# Altium project GN-1846-E-V2_HI3531A.PRJPCB (part 2 of 5)

## Sheet P11 Hi3531A(SYSTEM)&RES.SchDoc
size 420 x 297 mm
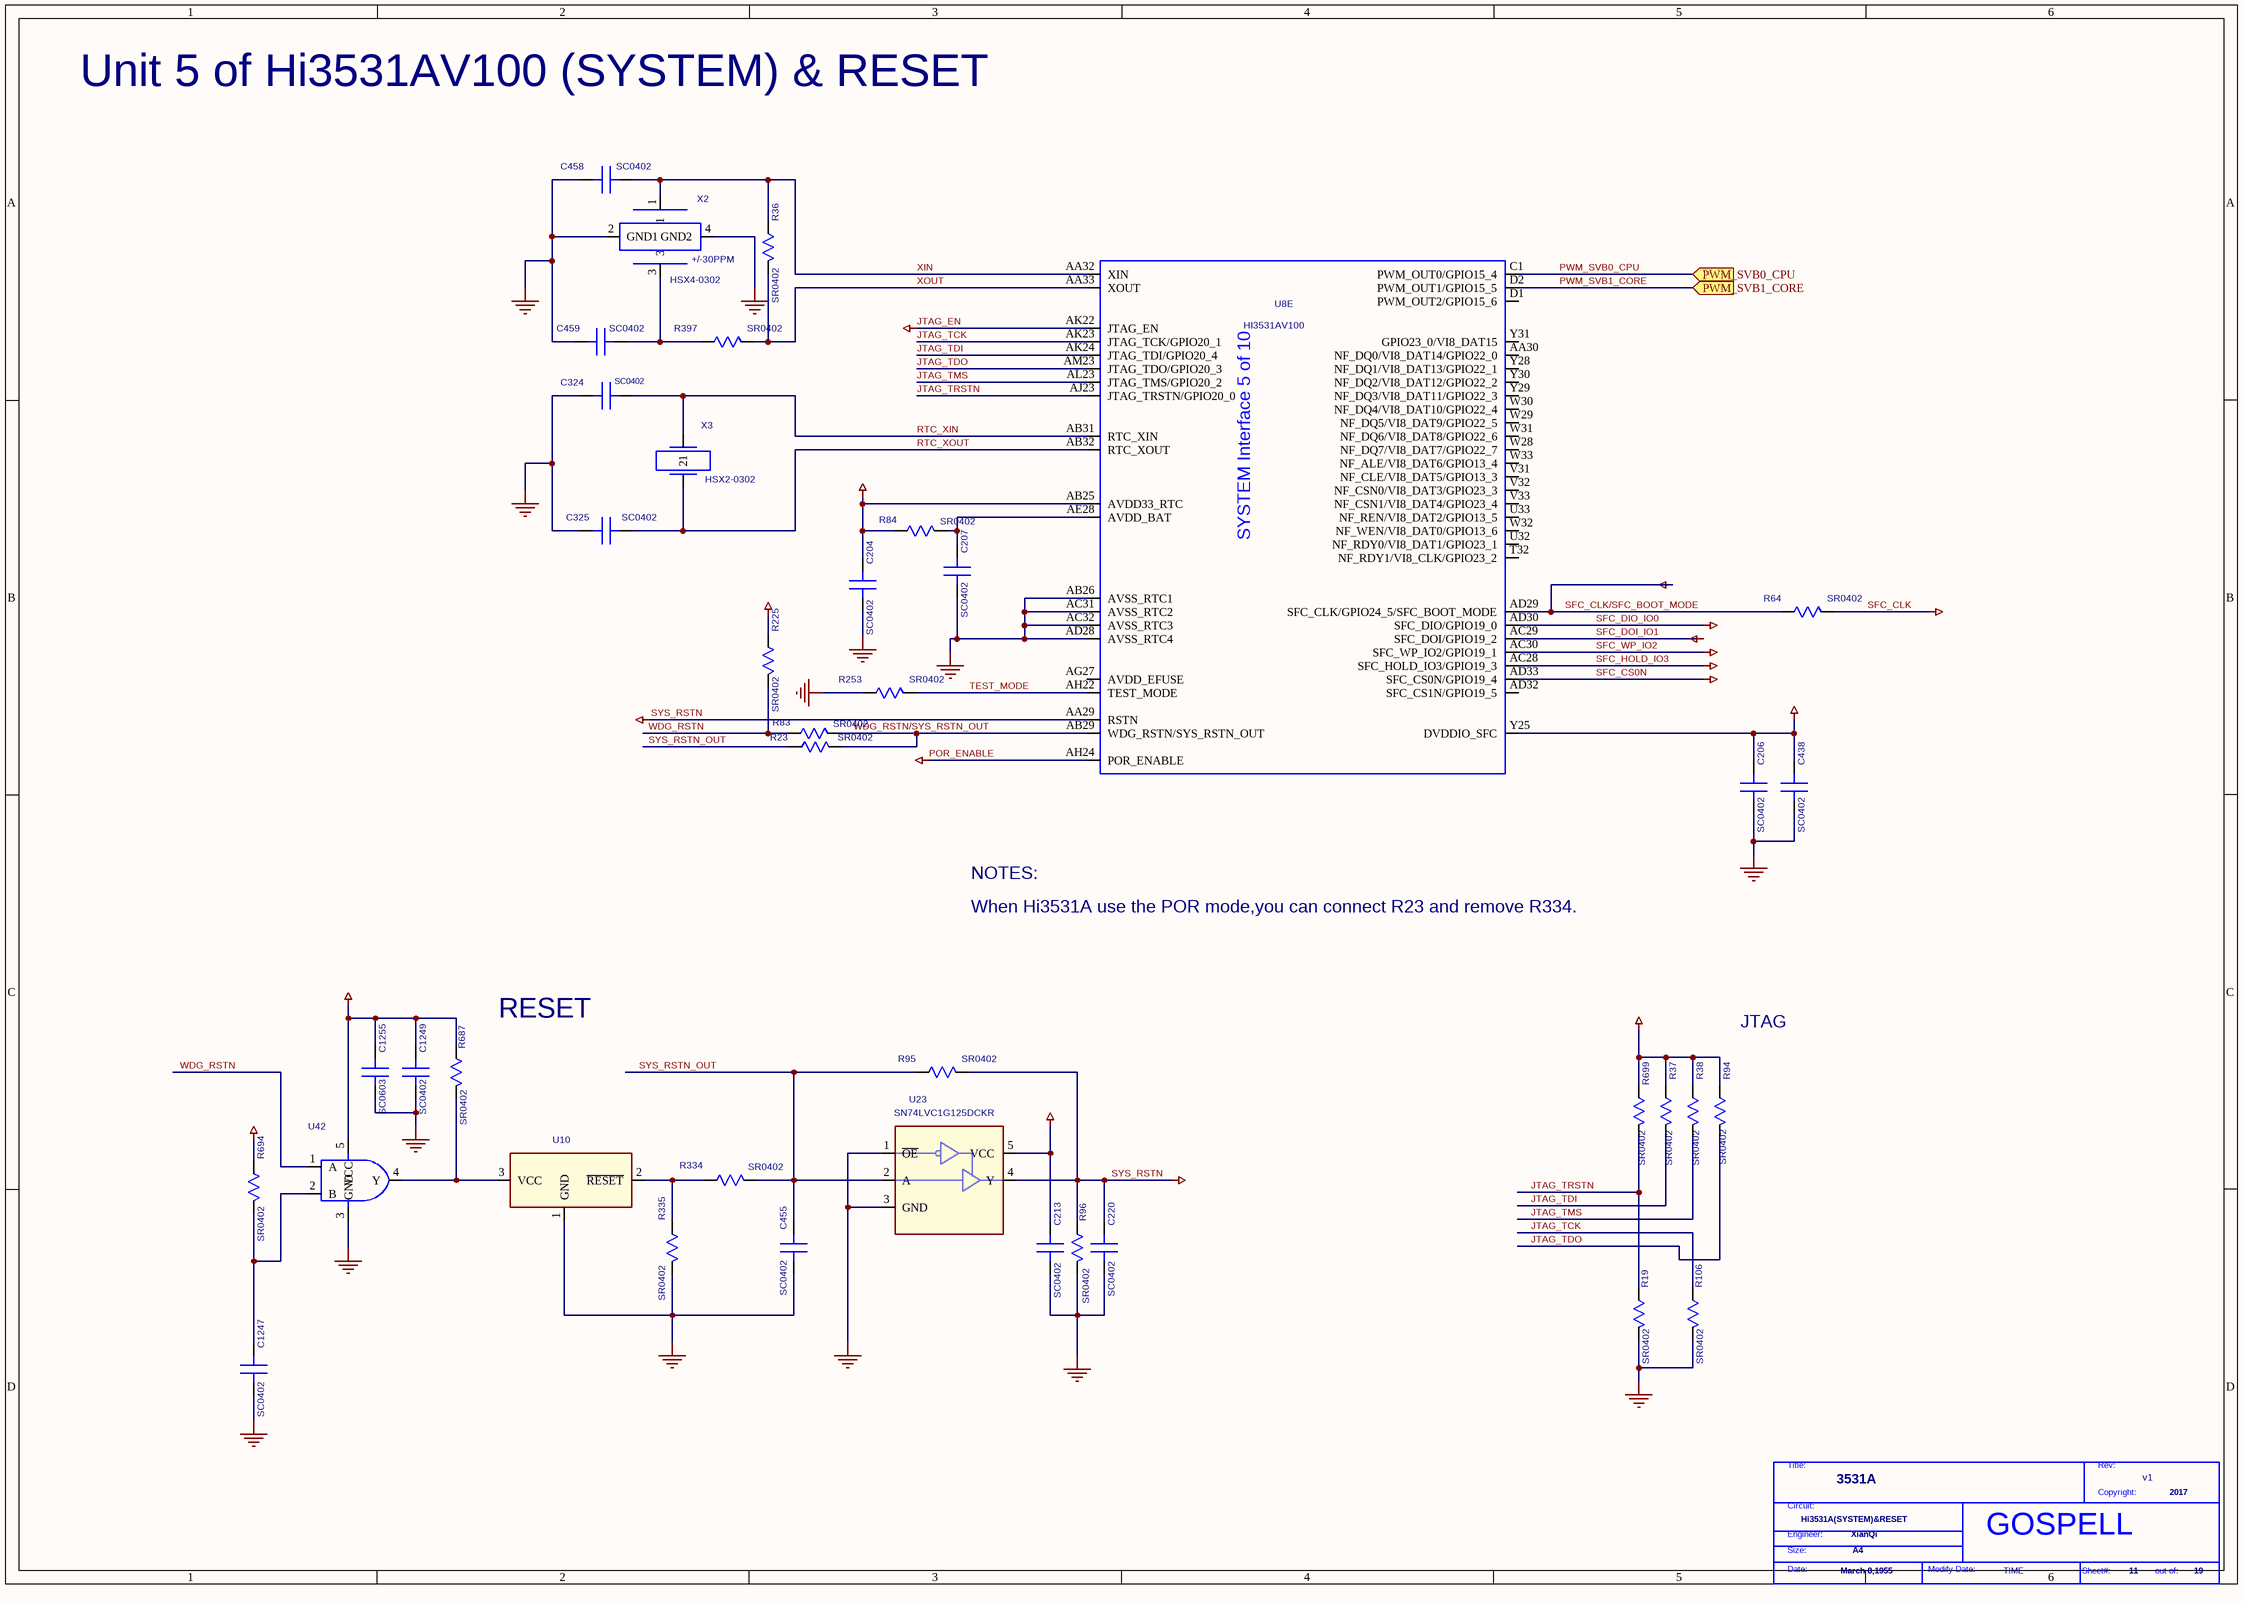
[diagram p7: P11 Hi3531A(SYSTEM)&RES.SchDoc]

### Parts
(Parts that share a designator on the sheet are numbered #1, #2 ... from top to bottom, then left to right.)
*#8  Page Modify Date: TIME  Engineer: XianQi  Copyright: 2017  Title: 3531A  RevCode: v1  Page Size: A4  Page Create Date: March 8,1955  Page Number: 11  Page Count: 19  Doc: Hi3531A(SYSTEM)&RESET  (hidden comment: GOSPELL)  (graphical)
C204  SC0402  [SC0402]
C206  SC0402  [SC0402]
C207  SC0402  [SC0402]
C213  SC0402  [SC0402]
C220  SC0402  [SC0402]
C324  SC0402  [SC0402]
C325  SC0402  [SC0402]
C438  SC0402  [SC0402]
C455  SC0402  [SC0402]
C458  SC0402  [SC0402]
C459  SC0402  [SC0402]
C1247  SC0402  [SC0402]
C1249  SC0402  [SC0402]
C1255  SC0603  [SC0603]
R19  SR0402  [SR0402]
R23  SR0402  [SR0402]
R36  SR0402  [SR0402]
R37  SR0402  [SR0402]
R38  SR0402  [SR0402]
R64  SR0402  [SR0402]
R83  SR0402  [SR0402]
R84  SR0402  [SR0402]
R94  SR0402  [SR0402]
R95  SR0402  [SR0402]
R96  SR0402  [SR0402]
R106  SR0402  [SR0402]
R225  SR0402  [SR0402]
R253  SR0402  [SR0402]
R334  SR0402  [SR0402]
R335  SR0402  [SR0402]
R397  SR0402  [SR0402]
R687  SR0402  [SR0402]
R694  SR0402  [SR0402]
R699  SR0402  [SR0402]
U8  DEVICE: HI3531AV100  [BGA805-32-3333]  (hidden comment: BGA805-32-3333)  (part E of 10)
U10  SOT23B  [SOT23B]  (value not drawn)
U23  DEVICE: SN74LVC1G125DCKR  [HSOT-SC70-DCK]  (hidden comment: HSOT-SC70-DCK)
U42  SOT23-5C  [SOT23-5C]  (value not drawn)
X2  HSX4-0302  [HSX4-0302]
X3  HSX2-0302  [HSX2-0302]

### Ports
PWM_SVB0_CPU (in), PWM_SVB1_CORE (in)

### Nets
3V3: C204.1(A) C206.1(A) C213.1(A) C438.1(A) C1249.1(A) C1255.1(A) R37.1(A) R38.1(A) R84.1(A) R94.1(A) R225.1(A) R687.1(A) R694.1(A) R699.1(A) U8.AB25(AVDD33_RTC) U8.Y25(DVDDIO_SFC) U23.5(VCC) U42.5(VCC)
GND: C204.2(B) C206.2(B) C207.2(B) C213.2(B) C220.2(B) C324.1(A) C325.1(A) C438.2(B) C455.2(B) C458.1(A) C459.1(A) C1247.2(B) C1249.2(B) C1255.2(B) R19.2(B) R96.2(B) R106.2(B) R253.1(A) R335.2(B) U8.AB26(AVSS_RTC1) U8.AC31(AVSS_RTC2) U8.AC32(AVSS_RTC3) U8.AD28(AVSS_RTC4) U10.1(GND) U23.1(~{OE}) U23.3(GND) U42.3(GND) X2.2(GND1) X2.4(GND2)
JTAG_EN: U8.AK22(JTAG_EN)
POR_ENABLE: U8.AH24(POR_ENABLE)
SFC_CLK: R64.2(B)
SFC_CLK/SFC_BOOT_MODE: R64.1(A) U8.AD29(SFC_CLK/GPIO24_5/SFC_BOOT_MODE)
SFC_CS0N: U8.AD33(SFC_CS0N/GPIO19_4)
SFC_DIO_IO0: U8.AD30(SFC_DIO/GPIO19_0)
SFC_DOI_IO1: U8.AC29(SFC_DOI/GPIO19_2)
SFC_HOLD_IO3: U8.AC28(SFC_HOLD_IO3/GPIO19_3)
SFC_WP_IO2: U8.AC30(SFC_WP_IO2/GPIO19_1)
SYS_RSTN: C220.1(A) R95.2(B) R96.1(A) U8.AA29(RSTN) U23.4(Y)
JTAG_TCK: R106.1(A) U8.AK23(JTAG_TCK/GPIO20_1)
JTAG_TDI: R37.2(B) U8.AK24(JTAG_TDI/GPIO20_4)
JTAG_TDO: R94.2(B) U8.AM23(JTAG_TDO/GPIO20_3)
JTAG_TMS: R38.2(B) U8.AL23(JTAG_TMS/GPIO20_2)
JTAG_TRSTN: R19.1(A) R699.2(B) U8.AJ23(JTAG_TRSTN/GPIO20_0)
PWM_SVB0_CPU: U8.C1(PWM_OUT0/GPIO15_4) ; port PWM_SVB0_CPU
PWM_SVB1_CORE: U8.D2(PWM_OUT1/GPIO15_5) ; port PWM_SVB1_CORE
RTC_XIN: C324.2(B) U8.AB31(RTC_XIN) X3.1
RTC_XOUT: C325.2(B) U8.AB32(RTC_XOUT) X3.2
SYS_RSTN_OUT: C455.1(A) R23.1(A) R95.1(A) R334.2(B) U23.2(A)
TEST_MODE: R253.2(B) U8.AH22(TEST_MODE)
WDG_RSTN: R83.1(A) R225.2(B) U42.1(A)
WDG_RSTN/SYS_RSTN_OUT: R23.2(B) R83.2(B) U8.AB29(WDG_RSTN/SYS_RSTN_OUT)
XIN: C458.2(B) R36.1(A) U8.AA32(XIN) X2.1
XOUT: R36.2(B) R397.2(B) U8.AA33(XOUT)
NetC207_1: C207.1(A) R84.2(B) U8.AE28(AVDD_BAT)
NetC459_2: C459.2(B) R397.1(A) X2.3
NetC1247_1: C1247.1(A) R694.2(B) U42.2(B)
NetR334_1: R334.1(A) R335.1(A) U10.2(~{RESET})
NetR687_2: R687.2(B) U10.3(VCC) U42.4(Y)

Not connected (* = marked no-connect by the designer): U8 AA30(NF_DQ0/VI8_DAT14/GPIO22_0) AD32(SFC_CS1N/GPIO19_5) AG27(AVDD_EFUSE) D1(PWM_OUT2/GPIO15_6) T32(NF_RDY1/VI8_CLK/GPIO23_2) U32(NF_RDY0/VI8_DAT1/GPIO23_1) U33(NF_REN/VI8_DAT2/GPIO13_5) V31(NF_CLE/VI8_DAT5/GPIO13_3) V32(NF_CSN0/VI8_DAT3/GPIO23_3) V33(NF_CSN1/VI8_DAT4/GPIO23_4) W28(NF_DQ7/VI8_DAT7/GPIO22_7) W29(NF_DQ5/VI8_DAT9/GPIO22_5) W30(NF_DQ4/VI8_DAT10/GPIO22_4) W31(NF_DQ6/VI8_DAT8/GPIO22_6) W32(NF_WEN/VI8_DAT0/GPIO13_6) W33(NF_ALE/VI8_DAT6/GPIO13_4) Y28(NF_DQ1/VI8_DAT13/GPIO22_1) Y29(NF_DQ3/VI8_DAT11/GPIO22_3) Y30(NF_DQ2/VI8_DAT12/GPIO22_2) Y31(GPIO23_0/VI8_DAT15)

### Notes on the sheet
- Unit 5 of Hi3531AV100 (SYSTEM) & RESET
- (near X2) +/-30PPM
- When Hi3531A use the POR mode,you can connect R23 and remove R334.
- NOTES:
- (near R687) RESET
- JTAG
- (in symbol GOSPELL) Title:; Rev:; Copyright:; Circuit:; Engineer:; Size:; Date:; Modify Date:; Sheet#:; out of:
- (in symbol HI3531AV100_M2_17, part E) SYSTEM Interface 5 of 10

### Library data of the parts
C204 C206 C207 C1247 = C_0_Dup2: PARTS: 1; PINSWAP: (A,B); LEVEL: STD; DEVICE: RMEMK105BJ104KV_FR; OriginalSymbolOrigin: (0,30); %208%%161%%192%%224%%195%%251%%179%%198%: SMD陶瓷电容; COMPONENT_HIGH_MAX: 0.55MM; %182%%238%%182%%168%%185%%164%%215%%247%%181%%231%%209%%185%(V): 16; %195%%232%%202%%246%: SMD陶瓷电容-16V-100NF-+/-10%-X7R-0402-BT; CODE: 8070614; PKG_TYPE: SC0402
C213 = C_0_Dup2: PARTS: 1; PINSWAP: (A,B); LEVEL: STD; DEVICE: RMEMK105BJ104KV_FR; OriginalSymbolOrigin: (0,30); CODE: 8070614; %195%%232%%202%%246%: SMD陶瓷电容-16V-100NF-+/-10%-X7R-0402-BT; %182%%238%%182%%168%%185%%164%%215%%247%%181%%231%%209%%185%(V): 16; COMPONENT_HIGH_MAX: 0.55MM; %208%%161%%192%%224%%195%%251%%179%%198%: SMD陶瓷电容; PKG_TYPE: SC0402
C220 C455 = C_0_Dup2: PARTS: 1; PINSWAP: (A,B); LEVEL: STD; DEVICE: 04025C102KAT2A; OriginalSymbolOrigin: (0,30); CODE: 8070531; %195%%232%%202%%246%: SMD陶瓷电容-50V-1NF-+/-10%-X7R-0402-BT; %182%%238%%182%%168%%185%%164%%215%%247%%181%%231%%209%%185%(V): 50; COMPONENT_HIGH_MAX: 0.56MM; %208%%161%%192%%224%%195%%251%%179%%198%: SMD陶瓷电容; PKG_TYPE: SC0402
C324 C325 = C_0_Dup2: PARTS: 1; PINSWAP: (A,B); LEVEL: STD; DEVICE: RMUMK105CG220JV_F; OriginalSymbolOrigin: (0,30); %208%%161%%192%%224%%195%%251%%179%%198%: SMD陶瓷电容; COMPONENT_HIGH_MAX: 0.55MM; %182%%238%%182%%168%%185%%164%%215%%247%%181%%231%%209%%185%(V): 50; %195%%232%%202%%246%: SMD陶瓷电容-50V-0.022NF-+/-5%-NP0-0402-BT; CODE: 8070545; PKG_TYPE: SC0402
C438 = C_0_Dup2: PARTS: 1; PINSWAP: (A,B); LEVEL: STD; DEVICE: C1005X5R0J475MTJ00F; OriginalSymbolOrigin: (0,30); %208%%161%%192%%224%%195%%251%%179%%198%: SMD陶瓷电容; COMPONENT_HIGH_MAX: 0.65MM; %182%%238%%182%%168%%185%%164%%215%%247%%181%%231%%209%%185%(V): 6.3; %195%%232%%202%%246%: SMD陶瓷电容-6.3V-4700NF-+/-20%-X5R-0402; CODE: 8071610; PKG_TYPE: SC0402
C458 C459 = C_0_Dup2: PARTS: 1; PINSWAP: (A,B); LEVEL: STD; DEVICE: C0402C150J5GAC_7867; OriginalSymbolOrigin: (0,30); CODE: 08070580; %195%%232%%202%%246%: SMD陶瓷电容-50V-0.015NF-+/-5%-NP0-0402; %182%%238%%182%%168%%185%%164%%215%%247%%181%%231%%209%%185%(V): 50; COMPONENT_HIGH_MAX: 0.55MM; %208%%161%%192%%224%%195%%251%%179%%198%: SMD陶瓷电容; PKG_TYPE: SC0402
C1249 = C_0_Dup2: PARTS: 1; PINSWAP: (A,B); LEVEL: STD; DEVICE: C0402C104K8PAC_7867; OriginalSymbolOrigin: (0,30); CODE: 8070561; %195%%232%%202%%246%: SMD陶瓷电容-10V-100NF-+/-10%-X5R-0402; %182%%238%%182%%168%%185%%164%%215%%247%%181%%231%%209%%185%(V): 10; COMPONENT_HIGH_MAX: 0.55MM; %208%%161%%192%%224%%195%%251%%179%%198%: SMD陶瓷电容; ALT_SYMBOLS: (T:SC0402;B:SC0402,SC0402-BGA,SC0402-BGA-A); TECHNIC: 回流回流; PKG_TYPE: SC0402
C1255 = C_0_Dup2: PARTS: 1; PINSWAP: (A,B); LEVEL: STD; DEVICE: C1608X5R0J106MT0A0E_A; OriginalSymbolOrigin: (0,30); %208%%161%%192%%224%%195%%251%%179%%198%: SMD陶瓷电容; COMPONENT_HIGH_MAX: 0.9MM; %182%%238%%182%%168%%185%%164%%215%%247%%181%%231%%209%%185%(V): 6.3; %195%%232%%202%%246%: SMD陶瓷电容-6.3V-10000NF-+/-20%-X5R-0603; CODE: 8070821; PKG_TYPE: SC0603
R19 = R_2: PARTS: 1; OriginalSymbolOrigin: (10,20); PINSWAP: (A,B); DEVICE: RK73H1ETTP1002F; LEVEL: STD; %208%%161%%192%%224%%195%%251%%179%%198%: 片式厚膜电阻器; COMPONENT_HIGH_MAX: 0.4MM; %215%%232%%214%%181%%212%%202%%208%%237%%198%%171%%178%%238%: +/-1%; %182%%238%%182%%168%%185%%166%%194%%202%(W): 0.06; %195%%232%%202%%246%: 片式厚膜电阻器-0.0625W-10000OHM-+/-1%-0402-BT; CODE: 7090867; PKG_TYPE: SR0402
R23 R95 = R_1: PARTS: 1; LEVEL: STD; DEVICE: RC0402JR_070R; PINSWAP: (A,B); OriginalSymbolOrigin: (10,20); CODE: 7090800; %195%%232%%202%%246%: 片式厚膜电阻器-0.0625W-0OHM-< 50MOHM-0402-1A-BT; %182%%238%%182%%168%%185%%166%%194%%202%(W): 0.06; %215%%232%%214%%181%%212%%202%%208%%237%%198%%171%%178%%238%: < 50MOHM; COMPONENT_HIGH_MAX: 0.4MM; %208%%161%%192%%224%%195%%251%%179%%198%: 片式厚膜电阻器; PKG_TYPE: SR0402
R36 = R_1: PARTS: 1; LEVEL: STD; DEVICE: RK73H1ETTP1004F; PINSWAP: (A,B); OriginalSymbolOrigin: (10,20); %208%%161%%192%%224%%195%%251%%179%%198%: 片式厚膜电阻器; COMPONENT_HIGH_MAX: 0.4MM; %215%%232%%214%%181%%212%%202%%208%%237%%198%%171%%178%%238%: ±1%; %182%%238%%182%%168%%185%%166%%194%%202%(W): 0.06; %195%%232%%202%%246%: 片式厚膜电阻器-0.0625W-1000000OHM-±1%-0402; CODE: 7090857; PKG_TYPE: SR0402
R37 = R_2: PARTS: 1; OriginalSymbolOrigin: (10,20); PINSWAP: (A,B); DEVICE: RK73B1ELTP472J; LEVEL: STD; %208%%161%%192%%224%%195%%251%%179%%198%: 片式厚膜电阻器; COMPONENT_HIGH_MAX: 0.4MM; %215%%232%%214%%181%%212%%202%%208%%237%%198%%171%%178%%238%: +/-5%; %182%%238%%182%%168%%185%%166%%194%%202%(W): 0.06; %195%%232%%202%%246%: 片式厚膜电阻器-0.0625W-4700OHM-+/-5%-0402-BT; CODE: 7090793; PKG_TYPE: SR0402
R38 R94 R699 = R_2: PARTS: 1; OriginalSymbolOrigin: (10,20); PINSWAP: (A,B); DEVICE: RK73B1ELTP472J; LEVEL: STD; CODE: 7090793; %195%%232%%202%%246%: 片式厚膜电阻器-0.0625W-4700OHM-+/-5%-0402-BT; %182%%238%%182%%168%%185%%166%%194%%202%(W): 0.06; %215%%232%%214%%181%%212%%202%%208%%237%%198%%171%%178%%238%: +/-5%; COMPONENT_HIGH_MAX: 0.4MM; %208%%161%%192%%224%%195%%251%%179%%198%: 片式厚膜电阻器; PKG_TYPE: SR0402
R64 = R_1: PARTS: 1; LEVEL: STD; DEVICE: RC0402FR_0733RL; PINSWAP: (A,B); OriginalSymbolOrigin: (10,20); CODE: 7090836; %195%%232%%202%%246%: 片式厚膜电阻器-0.0625W-33OHM-+/-1%-0402; %182%%238%%182%%168%%185%%166%%194%%202%(W): 0.06; %215%%232%%214%%181%%212%%202%%208%%237%%198%%171%%178%%238%: +/-1%; COMPONENT_HIGH_MAX: 0.4MM; %208%%161%%192%%224%%195%%251%%179%%198%: 片式厚膜电阻器; PKG_TYPE: SR0402
R83 R84 = R_1: PARTS: 1; LEVEL: STD; DEVICE: RC0402JR_070R; PINSWAP: (A,B); OriginalSymbolOrigin: (10,20); %208%%161%%192%%224%%195%%251%%179%%198%: 片式厚膜电阻器; COMPONENT_HIGH_MAX: 0.4MM; %215%%232%%214%%181%%212%%202%%208%%237%%198%%171%%178%%238%: < 50MOHM; %182%%238%%182%%168%%185%%166%%194%%202%(W): 0.06; %195%%232%%202%%246%: 片式厚膜电阻器-0.0625W-0OHM-< 50MOHM-0402-1A-BT; CODE: 7090800; PKG_TYPE: SR0402
R96 = R_1: PARTS: 1; LEVEL: STD; DEVICE: RC0402FR_071KL; PINSWAP: (A,B); OriginalSymbolOrigin: (10,20); %208%%161%%192%%224%%195%%251%%179%%198%: 片式厚膜电阻器; COMPONENT_HIGH_MAX: 0.4MM; %215%%232%%214%%181%%212%%202%%208%%237%%198%%171%%178%%238%: +/-1%; %182%%238%%182%%168%%185%%166%%194%%202%(W): 0.06; %195%%232%%202%%246%: 片式厚膜电阻器-0.0625W-1000OHM-+/-1%-0402-BT; CODE: 7091282; PKG_TYPE: SR0402
R106 = R_2: PARTS: 1; OriginalSymbolOrigin: (10,20); PINSWAP: (A,B); DEVICE: RC0402FR_071KL; LEVEL: STD; CODE: 7091282; %195%%232%%202%%246%: 片式厚膜电阻器-0.0625W-1000OHM-+/-1%-0402-BT; %182%%238%%182%%168%%185%%166%%194%%202%(W): 0.06; %215%%232%%214%%181%%212%%202%%208%%237%%198%%171%%178%%238%: +/-1%; COMPONENT_HIGH_MAX: 0.4MM; %208%%161%%192%%224%%195%%251%%179%%198%: 片式厚膜电阻器; PKG_TYPE: SR0402
R225 = R_1: PARTS: 1; LEVEL: STD; DEVICE: RK73B1ELTP472J; PINSWAP: (A,B); OriginalSymbolOrigin: (10,20); CODE: 7090793; %195%%232%%202%%246%: 片式厚膜电阻器-0.0625W-4700OHM-+/-5%-0402-BT; %182%%238%%182%%168%%185%%166%%194%%202%(W): 0.06; %215%%232%%214%%181%%212%%202%%208%%237%%198%%171%%178%%238%: +/-5%; COMPONENT_HIGH_MAX: 0.4MM; %208%%161%%192%%224%%195%%251%%179%%198%: 片式厚膜电阻器; PKG_TYPE: SR0402
R253 = R_1: PARTS: 1; LEVEL: STD; DEVICE: RK73B1ELTP472J; PINSWAP: (A,B); OriginalSymbolOrigin: (10,20); %208%%161%%192%%224%%195%%251%%179%%198%: 片式厚膜电阻器; COMPONENT_HIGH_MAX: 0.4MM; %215%%232%%214%%181%%212%%202%%208%%237%%198%%171%%178%%238%: +/-5%; %182%%238%%182%%168%%185%%166%%194%%202%(W): 0.06; %195%%232%%202%%246%: 片式厚膜电阻器-0.0625W-4700OHM-+/-5%-0402-BT; CODE: 7090793; PKG_TYPE: SR0402
R334 = R_1: PARTS: 1; LEVEL: STD; DEVICE: RC0402JR_07100R; PINSWAP: (A,B); OriginalSymbolOrigin: (10,20); %208%%161%%192%%224%%195%%251%%179%%198%: 片式厚膜电阻器; COMPONENT_HIGH_MAX: 0.4MM; %215%%232%%214%%181%%212%%202%%208%%237%%198%%171%%178%%238%: +/-5%; %182%%238%%182%%168%%185%%166%%194%%202%(W): 0.06; %195%%232%%202%%246%: 片式厚膜电阻器-0.0625W-100OHM-+/-5%-0402-BT; CODE: 7090807; PKG_TYPE: SR0402
R335 = R_1: PARTS: 1; LEVEL: STD; DEVICE: RK73H1ETTP1003F; PINSWAP: (A,B); OriginalSymbolOrigin: (10,20); %208%%161%%192%%224%%195%%251%%179%%198%: 片式厚膜电阻器; COMPONENT_HIGH_MAX: 0.4MM; %215%%232%%214%%181%%212%%202%%208%%237%%198%%171%%178%%238%: +/-1%; %182%%238%%182%%168%%185%%166%%194%%202%(W): 0.06; %195%%232%%202%%246%: 片式厚膜电阻器-0.0625W-100000OHM-+/-1%-0402; CODE: 7090875; PKG_TYPE: SR0402
R397 = R_1: PARTS: 1; LEVEL: STD; DEVICE: RC_02W100FT; PINSWAP: (A,B); OriginalSymbolOrigin: (10,20); %208%%161%%192%%224%%195%%251%%179%%198%: 片式厚膜电阻器; COMPONENT_HIGH_MAX: 0.4MM; %215%%232%%214%%181%%212%%202%%208%%237%%198%%171%%178%%238%: +/-1%; %182%%238%%182%%168%%185%%166%%194%%202%(W): 0.06; %195%%232%%202%%246%: 片式厚膜电阻器-0.0625W-10OHM-+/-1%-0402; CODE: 7091305; PKG_TYPE: SR0402
R687 = R_1: PARTS: 1; LEVEL: STD; DEVICE: RC0402JR_071KL; PINSWAP: (A,B); OriginalSymbolOrigin: (10,20); CODE: 7090809; %195%%232%%202%%246%: 片式厚膜电阻器-0.0625W-1000OHM-+/-5%-0402-BT; %182%%238%%182%%168%%185%%166%%194%%202%(W): 0.06; %215%%232%%214%%181%%212%%202%%208%%237%%198%%171%%178%%238%: +/-5%; %208%%161%%192%%224%%195%%251%%179%%198%: 片式厚膜电阻器; PKG_TYPE: SR0402
R694 = R_1: PARTS: 1; LEVEL: STD; DEVICE: RK73B1ELTP472J; PINSWAP: (A,B); OriginalSymbolOrigin: (10,20); %208%%161%%192%%224%%195%%251%%179%%198%: 片式厚膜电阻器; COMPONENT_HIGH_MAX: 0.4MM; %215%%232%%214%%181%%212%%202%%208%%237%%198%%171%%178%%238%: ±5％; %182%%238%%182%%168%%185%%166%%194%%202%(W): 0.06; %195%%232%%202%%246%: 片式厚膜电阻器-0.0625W-4700OHM-+/-5%-0402-BT; CODE: 7090793; PKG_TYPE: SR0402
U8 = HI3531AV100_M2_17: FORWARD_PCB: 1; HETERO: (HI3531AV100_DDR1),(HI3531AV100_DDR2),(HI3531AV100_SYSTEM),(HI3531AV100_AD),(HI3531AV100_VO),(HI3531AV100_M1),(HI3531AV100_M2),(HI3531AV100_POWER),(HI3531AV100_VSS1),(HI3531AV100_VSS2); LEVEL: STD; OriginalSymbolOrigin: (30,630); CaptureCellPackProp: HI3531AV100_M2E; CODE: 35020607; PARTS: 1; PKG_TYPE: BGA805-32-3333
U10 = ADM809_0: PARTS: 1; DEVICE: PT7M7809RTE; LEVEL: STD; CODE: 39070039; OriginalSymbolOrigin: (10,60); COMPONENT_HIGH_MAX: 1.45MM; %195%%232%%202%%246%: POWER MANAGEMENT IC-3.3V-电压监测-2.63VTH-PUSH-PULL OUTPUT-SOT23-终端专用; PKG_TYPE: SOT23B
U23 = SN74LVC1G125Q-Q1_1: PARTS: 1; LEVEL: STD; CODE: 36020340; OriginalSymbolOrigin: (10,90); %195%%232%%202%%246%: CMOS-单门三态缓冲器-SOT23-6.9NS-24MA-LVTTL-LVTTL; %208%%161%%192%%224%%195%%251%%179%%198%: CMOS; SIGNAL_MODEL: 74LVC1G125DBVR_SOT5; PKG_TYPE: HSOT-SC70-DCK
U42 = NC7SZ08P5X_0: PARTS: 1; DEVICE: NC7SV08P5X; LEVEL: STD; CODE: 36020363; OriginalSymbolOrigin: (20,50); %195%%232%%202%%246%: CMOS-SINGLE 2-INPUT POSITIVE-AND GATE-SC-70-2.4NS-16MA-CMOS-CMOS-终端专用; COMPONENT_HIGH_MAX: 1.1MM; PKG_TYPE: SOT23-5C
X2 = X_B_7: PARTS: 1; CODE: 12020151; DEVICE: NX3225SA24MHZ; LEVEL: STD; OriginalSymbolOrigin: (20,80); COMPONENT_HIGH_MAX: 0.75MM; %195%%232%%202%%246%: 晶体谐振器-24MHZ-12PF-±30PPM-50OHM-HCX-3SB-终端专用; PKG_TYPE: HSX4-0302
X3 = X_1: PARTS: 1; CODE: 12020212; DEVICE: 9H03200019; LEVEL: STD; OriginalSymbolOrigin: (10,40); %195%%232%%202%%246%: 晶体谐振器-0.032768MHZ-12.5PF-+/-20PPM-70000OHM-SMD3.2*1.5; COMPONENT_HIGH_MAX: 0.85MM; %208%%161%%192%%224%%195%%251%%179%%198%: 晶体谐振器; PKG_TYPE: HSX2-0302

## Sheet P10 DDRC&D NOVTT.SchDoc
size 420 x 297 mm
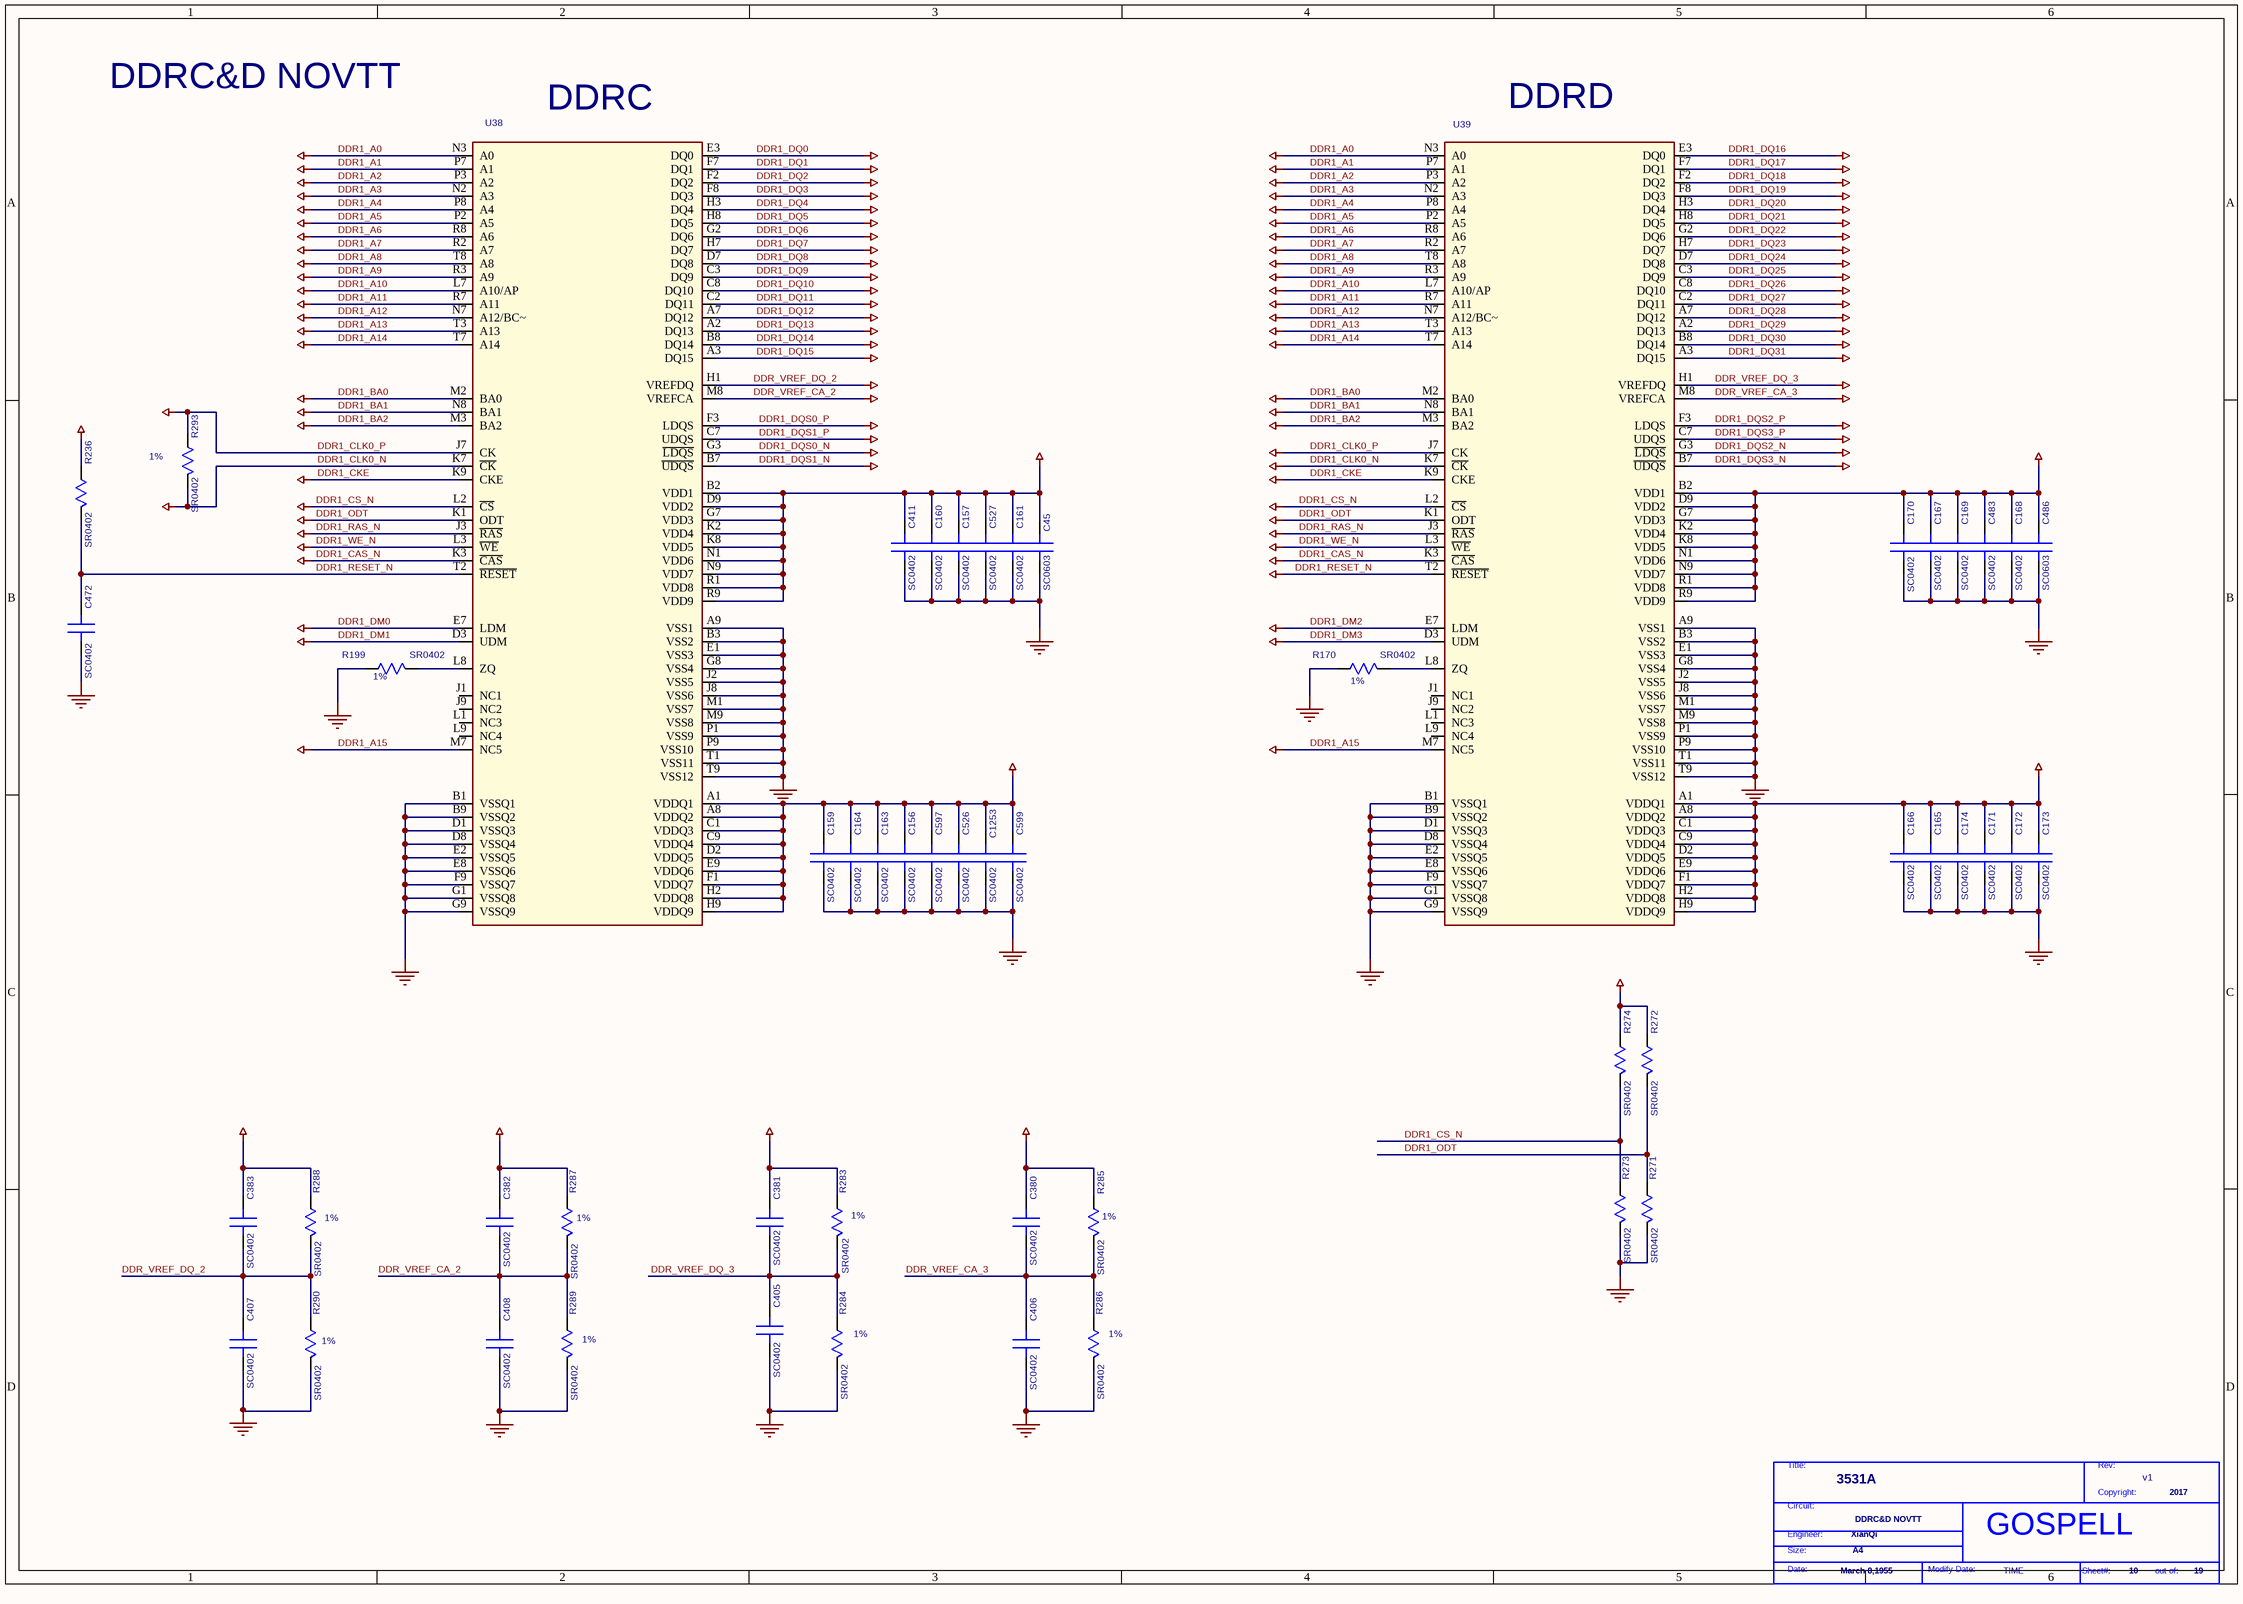
[diagram p8: P10 DDRC&D NOVTT.SchDoc]

### Parts
(Parts that share a designator on the sheet are numbered #1, #2 ... from top to bottom, then left to right.)
*#9  Page Modify Date: TIME  Engineer: XianQi  Copyright: 2017  Title: 3531A  RevCode: v1  Page Size: A4  Page Create Date: March 8,1955  Page Number: 10  Page Count: 19  Doc: DDRC&D NOVTT  (hidden comment: GOSPELL)  (graphical)
C45  SC0603  [SC0603]
C156  SC0402  [SC0402]
C157  SC0402  [SC0402]
C159  SC0402  [SC0402]
C160  SC0402  [SC0402]
C161  SC0402  [SC0402]
C163  SC0402  [SC0402]
C164  SC0402  [SC0402]
C165  SC0402  [SC0402]
C166  SC0402  [SC0402]
C167  SC0402  [SC0402]
C168  SC0402  [SC0402]
C169  SC0402  [SC0402]
C170  SC0402  [SC0402]
C171  SC0402  [SC0402]
C172  SC0402  [SC0402]
C173  SC0402  [SC0402]
C174  SC0402  [SC0402]
C380  SC0402  [SC0402]
C381  SC0402  [SC0402]
C382  SC0402  [SC0402]
C383  SC0402  [SC0402]
C405  SC0402  [SC0402]
C406  SC0402  [SC0402]
C407  SC0402  [SC0402]
C408  SC0402  [SC0402]
C411  SC0402  [SC0402]
C472  SC0402  [SC0402]
C483  SC0402  [SC0402]
C486  SC0603  [SC0603]
C526  SC0402  [SC0402]
C527  SC0402  [SC0402]
C597  SC0402  [SC0402]
C599  SC0402  [SC0402]
C1253  SC0402  [SC0402]
R170  SR0402  [SR0402]
R199  SR0402  [SR0402]
R236  SR0402  [SR0402]
R271  SR0402  [SR0402]
R272  SR0402  [SR0402]
R273  SR0402  [SR0402]
R274  SR0402  [SR0402]
R283  SR0402  [SR0402]
R284  SR0402  [SR0402]
R285  SR0402  [SR0402]
R286  SR0402  [SR0402]
R287  SR0402  [SR0402]
R288  SR0402  [SR0402]
R289  SR0402  [SR0402]
R290  SR0402  [SR0402]
R293  SR0402  [SR0402]
U38  BGA96-32-1609M  [BGA96-32-1609M]  (value not drawn)
U39  BGA96-32-1609M  [BGA96-32-1609M]  (value not drawn)

### Nets
1V5: C45.1(A) C156.1(A) C157.1(A) C159.1(A) C160.1(A) C161.1(A) C163.1(A) C164.1(A) C165.1(A) C166.1(A) C167.1(A) C168.1(A) C169.1(A) C170.1(A) C171.1(A) C172.1(A) C173.1(A) C174.1(A) C380.1(A) C381.1(A) C382.1(A) C383.1(A) C411.1(A) C483.1(A) C486.1(A) C526.1(A) C527.1(A) C597.1(A) C599.1(A) C1253.1(A) R236.1(A) R272.1(A) R274.1(A) R283.1(A) R285.1(A) R287.1(A) R288.1(A) U38.A1(VDDQ1) U38.A8(VDDQ2) U38.B2(VDD1) U38.C1(VDDQ3) U38.C9(VDDQ4) U38.D2(VDDQ5) U38.D9(VDD2) U38.E9(VDDQ6) U38.F1(VDDQ7) U38.G7(VDD3) U38.H2(VDDQ8) U38.H9(VDDQ9) U38.K2(VDD4) U38.K8(VDD5) U38.N1(VDD6) U38.N9(VDD7) U38.R1(VDD8) U38.R9(VDD9) U39.A1(VDDQ1) U39.A8(VDDQ2) U39.B2(VDD1) U39.C1(VDDQ3) U39.C9(VDDQ4) U39.D2(VDDQ5) U39.D9(VDD2) U39.E9(VDDQ6) U39.F1(VDDQ7) U39.G7(VDD3) U39.H2(VDDQ8) U39.H9(VDDQ9) U39.K2(VDD4) U39.K8(VDD5) U39.N1(VDD6) U39.N9(VDD7) U39.R1(VDD8) U39.R9(VDD9)
DDR1_A0: U38.N3(A0) U39.N3(A0)
DDR1_A1: U38.P7(A1) U39.P7(A1)
DDR1_A2: U38.P3(A2) U39.P3(A2)
DDR1_A3: U38.N2(A3) U39.N2(A3)
DDR1_A4: U38.P8(A4) U39.P8(A4)
DDR1_A5: U38.P2(A5) U39.P2(A5)
DDR1_A6: U38.R8(A6) U39.R8(A6)
DDR1_A7: U38.R2(A7) U39.R2(A7)
DDR1_A8: U38.T8(A8) U39.T8(A8)
DDR1_A9: U38.R3(A9) U39.R3(A9)
DDR1_A10: U38.L7(A10/AP) U39.L7(A10/AP)
DDR1_A11: U38.R7(A11) U39.R7(A11)
DDR1_A12: U38.N7(A12/BC~) U39.N7(A12/BC~)
DDR1_A13: U38.T3(A13) U39.T3(A13)
DDR1_A14: U38.T7(A14) U39.T7(A14)
DDR1_A15: U38.M7(NC5) U39.M7(NC5)
DDR1_BA0: U38.M2(BA0) U39.M2(BA0)
DDR1_BA1: U38.N8(BA1) U39.N8(BA1)
DDR1_BA2: U38.M3(BA2) U39.M3(BA2)
DDR1_CAS_N: U38.K3(~{CAS}) U39.K3(~{CAS})
DDR1_CKE: U38.K9(CKE) U39.K9(CKE)
DDR1_CLK0_N: R293.2(B) U38.K7(~{CK}) U39.K7(~{CK})
DDR1_CLK0_P: R293.1(A) U38.J7(CK) U39.J7(CK)
DDR1_CS_N: R273.1(A) R274.2(B) U38.L2(~{CS}) U39.L2(~{CS})
DDR1_DM0: U38.E7(LDM)
DDR1_DM1: U38.D3(UDM)
DDR1_DM2: U39.E7(LDM)
DDR1_DM3: U39.D3(UDM)
DDR1_DQ0: U38.E3(DQ0)
DDR1_DQ1: U38.F7(DQ1)
DDR1_DQ2: U38.F2(DQ2)
DDR1_DQ3: U38.F8(DQ3)
DDR1_DQ4: U38.H3(DQ4)
DDR1_DQ5: U38.H8(DQ5)
DDR1_DQ6: U38.G2(DQ6)
DDR1_DQ7: U38.H7(DQ7)
DDR1_DQ8: U38.D7(DQ8)
DDR1_DQ9: U38.C3(DQ9)
DDR1_DQ10: U38.C8(DQ10)
DDR1_DQ11: U38.C2(DQ11)
DDR1_DQ12: U38.A7(DQ12)
DDR1_DQ13: U38.A2(DQ13)
DDR1_DQ14: U38.B8(DQ14)
DDR1_DQ15: U38.A3(DQ15)
DDR1_DQ16: U39.E3(DQ0)
DDR1_DQ17: U39.F7(DQ1)
DDR1_DQ18: U39.F2(DQ2)
DDR1_DQ19: U39.F8(DQ3)
DDR1_DQ20: U39.H3(DQ4)
DDR1_DQ21: U39.H8(DQ5)
DDR1_DQ22: U39.G2(DQ6)
DDR1_DQ23: U39.H7(DQ7)
DDR1_DQ24: U39.D7(DQ8)
DDR1_DQ25: U39.C3(DQ9)
DDR1_DQ26: U39.C8(DQ10)
DDR1_DQ27: U39.C2(DQ11)
DDR1_DQ28: U39.A7(DQ12)
DDR1_DQ29: U39.A2(DQ13)
DDR1_DQ30: U39.B8(DQ14)
DDR1_DQ31: U39.A3(DQ15)
DDR1_DQS0_N: U38.G3(~{LDQS})
DDR1_DQS0_P: U38.F3(LDQS)
DDR1_DQS1_N: U38.B7(~{UDQS})
DDR1_DQS1_P: U38.C7(UDQS)
DDR1_DQS2_N: U39.G3(~{LDQS})
DDR1_DQS2_P: U39.F3(LDQS)
DDR1_DQS3_N: U39.B7(~{UDQS})
DDR1_DQS3_P: U39.C7(UDQS)
DDR1_ODT: R271.1(A) R272.2(B) U38.K1(ODT) U39.K1(ODT)
DDR1_RAS_N: U38.J3(~{RAS}) U39.J3(~{RAS})
DDR1_RESET_N: C472.1(A) R236.2(B) U38.T2(~{RESET}) U39.T2(~{RESET})
DDR1_WE_N: U38.L3(~{WE}) U39.L3(~{WE})
DDR_VREF_CA_2: C382.2(B) C408.1(A) R287.2(B) R289.1(A) U38.M8(VREFCA)
DDR_VREF_CA_3: C380.2(B) C406.1(A) R285.2(B) R286.1(A) U39.M8(VREFCA)
DDR_VREF_DQ_2: C383.2(B) C407.1(A) R288.2(B) R290.1(A) U38.H1(VREFDQ)
DDR_VREF_DQ_3: C381.2(B) C405.1(A) R283.2(B) R284.1(A) U39.H1(VREFDQ)
GND: C45.2(B) C156.2(B) C157.2(B) C159.2(B) C160.2(B) C161.2(B) C163.2(B) C164.2(B) C165.2(B) C166.2(B) C167.2(B) C168.2(B) C169.2(B) C170.2(B) C171.2(B) C172.2(B) C173.2(B) C174.2(B) C405.2(B) C406.2(B) C407.2(B) C408.2(B) C411.2(B) C472.2(B) C483.2(B) C486.2(B) C526.2(B) C527.2(B) C597.2(B) C599.2(B) C1253.2(B) R170.1(A) R199.1(A) R271.2(B) R273.2(B) R284.2(B) R286.2(B) R289.2(B) R290.2(B) U38.A9(VSS1) U38.B1(VSSQ1) U38.B3(VSS2) U38.B9(VSSQ2) U38.D1(VSSQ3) U38.D8(VSSQ4) U38.E1(VSS3) U38.E2(VSSQ5) U38.E8(VSSQ6) U38.F9(VSSQ7) U38.G1(VSSQ8) U38.G8(VSS4) U38.G9(VSSQ9) U38.J2(VSS5) U38.J8(VSS6) U38.M1(VSS7) U38.M9(VSS8) U38.P1(VSS9) U38.P9(VSS10) U38.T1(VSS11) U38.T9(VSS12) U39.A9(VSS1) U39.B1(VSSQ1) U39.B3(VSS2) U39.B9(VSSQ2) U39.D1(VSSQ3) U39.D8(VSSQ4) U39.E1(VSS3) U39.E2(VSSQ5) U39.E8(VSSQ6) U39.F9(VSSQ7) U39.G1(VSSQ8) U39.G8(VSS4) U39.G9(VSSQ9) U39.J2(VSS5) U39.J8(VSS6) U39.M1(VSS7) U39.M9(VSS8) U39.P1(VSS9) U39.P9(VSS10) U39.T1(VSS11) U39.T9(VSS12)
NetR170_2: R170.2(B) U39.L8(ZQ)
NetR199_2: R199.2(B) U38.L8(ZQ)

Not connected (* = marked no-connect by the designer): U38 J1(NC1) J9(NC2) L1(NC3) L9(NC4); U39 J1(NC1) J9(NC2) L1(NC3) L9(NC4)

### Notes on the sheet
- DDRC&D NOVTT
- (near U38) DDRC
- (near U39) DDRD
- (near R293) 1%
- (near R199) 1%
- (near R170) 1%
- (near R288) 1%
- (near R287) 1%
- (near R283) 1%
- (near R285) 1%
- (near R290) 1%
- (near R289) 1%
- (near R284) 1%
- (near R286) 1%
- (in symbol GOSPELL) Title:; Rev:; Copyright:; Circuit:; Engineer:; Size:; Date:; Modify Date:; Sheet#:; out of:

### Library data of the parts
C45 C486 = C_0_Dup2: PARTS: 1; PINSWAP: (A,B); LEVEL: STD; DEVICE: C1608X5R0J106MT0A0E; OriginalSymbolOrigin: (0,30); CODE: 8070649; %195%%232%%202%%246%: SMD陶瓷电容-6.3V-10000NF-+/-20%-X5R-0603-BT,TS16949; %182%%238%%182%%168%%185%%164%%215%%247%%181%%231%%209%%185%(V): 6.3; COMPONENT_HIGH_MAX: 0.9MM; %208%%161%%192%%224%%195%%251%%179%%198%: SMD陶瓷电容; PKG_TYPE: SC0603
C156 C159 C163 C167 C173 C174 C380 C382 C383 C411 = C_0_Dup2: as C213 on sheet P11 Hi3531A(SYSTEM)&RES; PKG_TYPE: SC0402
C157 C160 C164-C166 C170 C381 C405-C408 = C_0_Dup2: as C204 on sheet P11 Hi3531A(SYSTEM)&RES; PKG_TYPE: SC0402
C161 C172 = C_0_Dup2: PARTS: 1; PINSWAP: (A,B); LEVEL: STD; DEVICE: CV05X5R105K10AH; OriginalSymbolOrigin: (0,30); %208%%161%%192%%224%%195%%251%%179%%198%: SMD陶瓷电容; COMPONENT_HIGH_MAX: 0.55MM; %182%%238%%182%%168%%185%%164%%215%%247%%181%%231%%209%%185%(V): 10; %195%%232%%202%%246%: SMD陶瓷电容-10V-1000NF-+/-10%-X5R-0402-BT,TS16949; CODE: 8070612; PKG_TYPE: SC0402
C168 C483 C599 C1253 = C_0_Dup2: PARTS: 1; PINSWAP: (A,B); LEVEL: STD; DEVICE: CV05X5R105K10AH; OriginalSymbolOrigin: (0,30); CODE: 8070612; %195%%232%%202%%246%: SMD陶瓷电容-10V-1000NF-+/-10%-X5R-0402-BT,TS16949; %182%%238%%182%%168%%185%%164%%215%%247%%181%%231%%209%%185%(V): 10; COMPONENT_HIGH_MAX: 0.55MM; %208%%161%%192%%224%%195%%251%%179%%198%: SMD陶瓷电容; PKG_TYPE: SC0402
C169 C526 C527 = C_0_Dup2: PARTS: 1; PINSWAP: (A,B); LEVEL: STD; DEVICE: GRM155R60J474KE19D; OriginalSymbolOrigin: (0,30); %208%%161%%192%%224%%195%%251%%179%%198%: SMD陶瓷电容; COMPONENT_HIGH_MAX: 0.55MM; %182%%238%%182%%168%%185%%164%%215%%247%%181%%231%%209%%185%(V): 6.3; %195%%232%%202%%246%: SMD陶瓷电容-6.3V-470NF-+/-10%-X5R-0402; CODE: 8070625; PKG_TYPE: SC0402
C171 C597 = C_0_Dup2: PARTS: 1; PINSWAP: (A,B); LEVEL: STD; DEVICE: GRM155R60J474KE19D; OriginalSymbolOrigin: (0,30); CODE: 8070625; %195%%232%%202%%246%: SMD陶瓷电容-6.3V-470NF-+/-10%-X5R-0402; %182%%238%%182%%168%%185%%164%%215%%247%%181%%231%%209%%185%(V): 6.3; COMPONENT_HIGH_MAX: 0.55MM; %208%%161%%192%%224%%195%%251%%179%%198%: SMD陶瓷电容; PKG_TYPE: SC0402
C472 = C_0_Dup2: PARTS: 1; PINSWAP: (A,B); LEVEL: STD; DEVICE: 04025C102KAT2A; OriginalSymbolOrigin: (0,30); %208%%161%%192%%224%%195%%251%%179%%198%: SMD陶瓷电容; COMPONENT_HIGH_MAX: 0.56MM; %182%%238%%182%%168%%185%%164%%215%%247%%181%%231%%209%%185%(V): 50; %195%%232%%202%%246%: SMD陶瓷电容-50V-1NF-+/-10%-X7R-0402-BT; CODE: 8070531; PKG_TYPE: SC0402
R170 R199 = R_1: PARTS: 1; LEVEL: STD; DEVICE: RC0402FR_07240RL; PINSWAP: (A,B); OriginalSymbolOrigin: (10,20); CODE: 7091782; %195%%232%%202%%246%: 片式厚膜电阻器-0.0625W-240OHM-+/- 1%-0402-BT; %182%%238%%182%%168%%185%%166%%194%%202%(W): 0.06; %215%%232%%214%%181%%212%%202%%208%%237%%198%%171%%178%%238%: +/- 1%; COMPONENT_HIGH_MAX: 0.4MM; %208%%161%%192%%224%%195%%251%%179%%198%: 片式厚膜电阻器; PKG_TYPE: SR0402
R236 = R_1: PARTS: 1; LEVEL: STD; DEVICE: RK73H1ETTP1002F; PINSWAP: (A,B); OriginalSymbolOrigin: (10,20); CODE: 7090867; %195%%232%%202%%246%: 片式厚膜电阻器-0.0625W-10000OHM-+/-1%-0402-BT; %182%%238%%182%%168%%185%%166%%194%%202%(W): 0.06; %215%%232%%214%%181%%212%%202%%208%%237%%198%%171%%178%%238%: +/-1%; COMPONENT_HIGH_MAX: 0.4MM; %208%%161%%192%%224%%195%%251%%179%%198%: 片式厚膜电阻器; PKG_TYPE: SR0402
R271 R272 = R_1: PARTS: 1; LEVEL: STD; DEVICE: RC0402JR_07100R; PINSWAP: (A,B); OriginalSymbolOrigin: (10,20); CODE: 7090807; %195%%232%%202%%246%: 片式厚膜电阻器-0.0625W-100OHM-+/-5%-0402-BT; %182%%238%%182%%168%%185%%166%%194%%202%(W): 0.06; %215%%232%%214%%181%%212%%202%%208%%237%%198%%171%%178%%238%: +/-5%; COMPONENT_HIGH_MAX: 0.4MM; %208%%161%%192%%224%%195%%251%%179%%198%: 片式厚膜电阻器; PKG_TYPE: SR0402
R273 R274 = R_1: as R334 on sheet P11 Hi3531A(SYSTEM)&RES; PKG_TYPE: SR0402
R283 R285 R286 R289 = R_1: PARTS: 1; LEVEL: STD; DEVICE: RC0402FR_071KL; PINSWAP: (A,B); OriginalSymbolOrigin: (10,20); CODE: 7091282; %195%%232%%202%%246%: 片式厚膜电阻器-0.0625W-1000OHM-+/-1%-0402-BT; %182%%238%%182%%168%%185%%166%%194%%202%(W): 0.06; %215%%232%%214%%181%%212%%202%%208%%237%%198%%171%%178%%238%: +/-1%; COMPONENT_HIGH_MAX: 0.4MM; %208%%161%%192%%224%%195%%251%%179%%198%: 片式厚膜电阻器; PKG_TYPE: SR0402
R284 R287 R288 R290 = R_1: as R96 on sheet P11 Hi3531A(SYSTEM)&RES; PKG_TYPE: SR0402
R293 = R_1: PARTS: 1; LEVEL: STD; DEVICE: RC_02W69R8FT; PINSWAP: (A,B); OriginalSymbolOrigin: (10,20); %208%%161%%192%%224%%195%%251%%179%%198%: 片式厚膜电阻器; COMPONENT_HIGH_MAX: 0.4MM; %215%%232%%214%%181%%212%%202%%208%%237%%198%%171%%178%%238%: +/-1%; %182%%238%%182%%168%%185%%166%%194%%202%(W): 0.06; %195%%232%%202%%246%: 片式厚膜电阻器-0.0625W-69.8OHM-+/-1%-0402; CODE: 7091319; PKG_TYPE: SR0402
U38 = MT41J256M16RE-15E-D_2: PARTS: 1; DEVICE: H5TQ4G63AFR_RDC; LEVEL: STD; OriginalSymbolOrigin: (10,590); COMPONENT_HIGH_MAX: 1.2MM; %195%%232%%202%%246%: DDR3 DRAM-4GBIT-933MHZ-16BIT-1.5V-FBGA96(无铅)-终端专用-00777465; CODE: 40020344; PKG_TYPE: BGA96-32-1609M
U39 = MT41J256M16RE-15E-D_2: PARTS: 1; DEVICE: H5TQ4G63AFR_RDC; LEVEL: STD; OriginalSymbolOrigin: (10,590); CODE: 40020344; %195%%232%%202%%246%: DDR3 DRAM-4GBIT-933MHZ-16BIT-1.5V-FBGA96(无铅)-终端专用-00777465; COMPONENT_HIGH_MAX: 1.2MM; PKG_TYPE: BGA96-32-1609M

## Sheet P09 DDRA&B NOVTT.SchDoc
size 420 x 297 mm
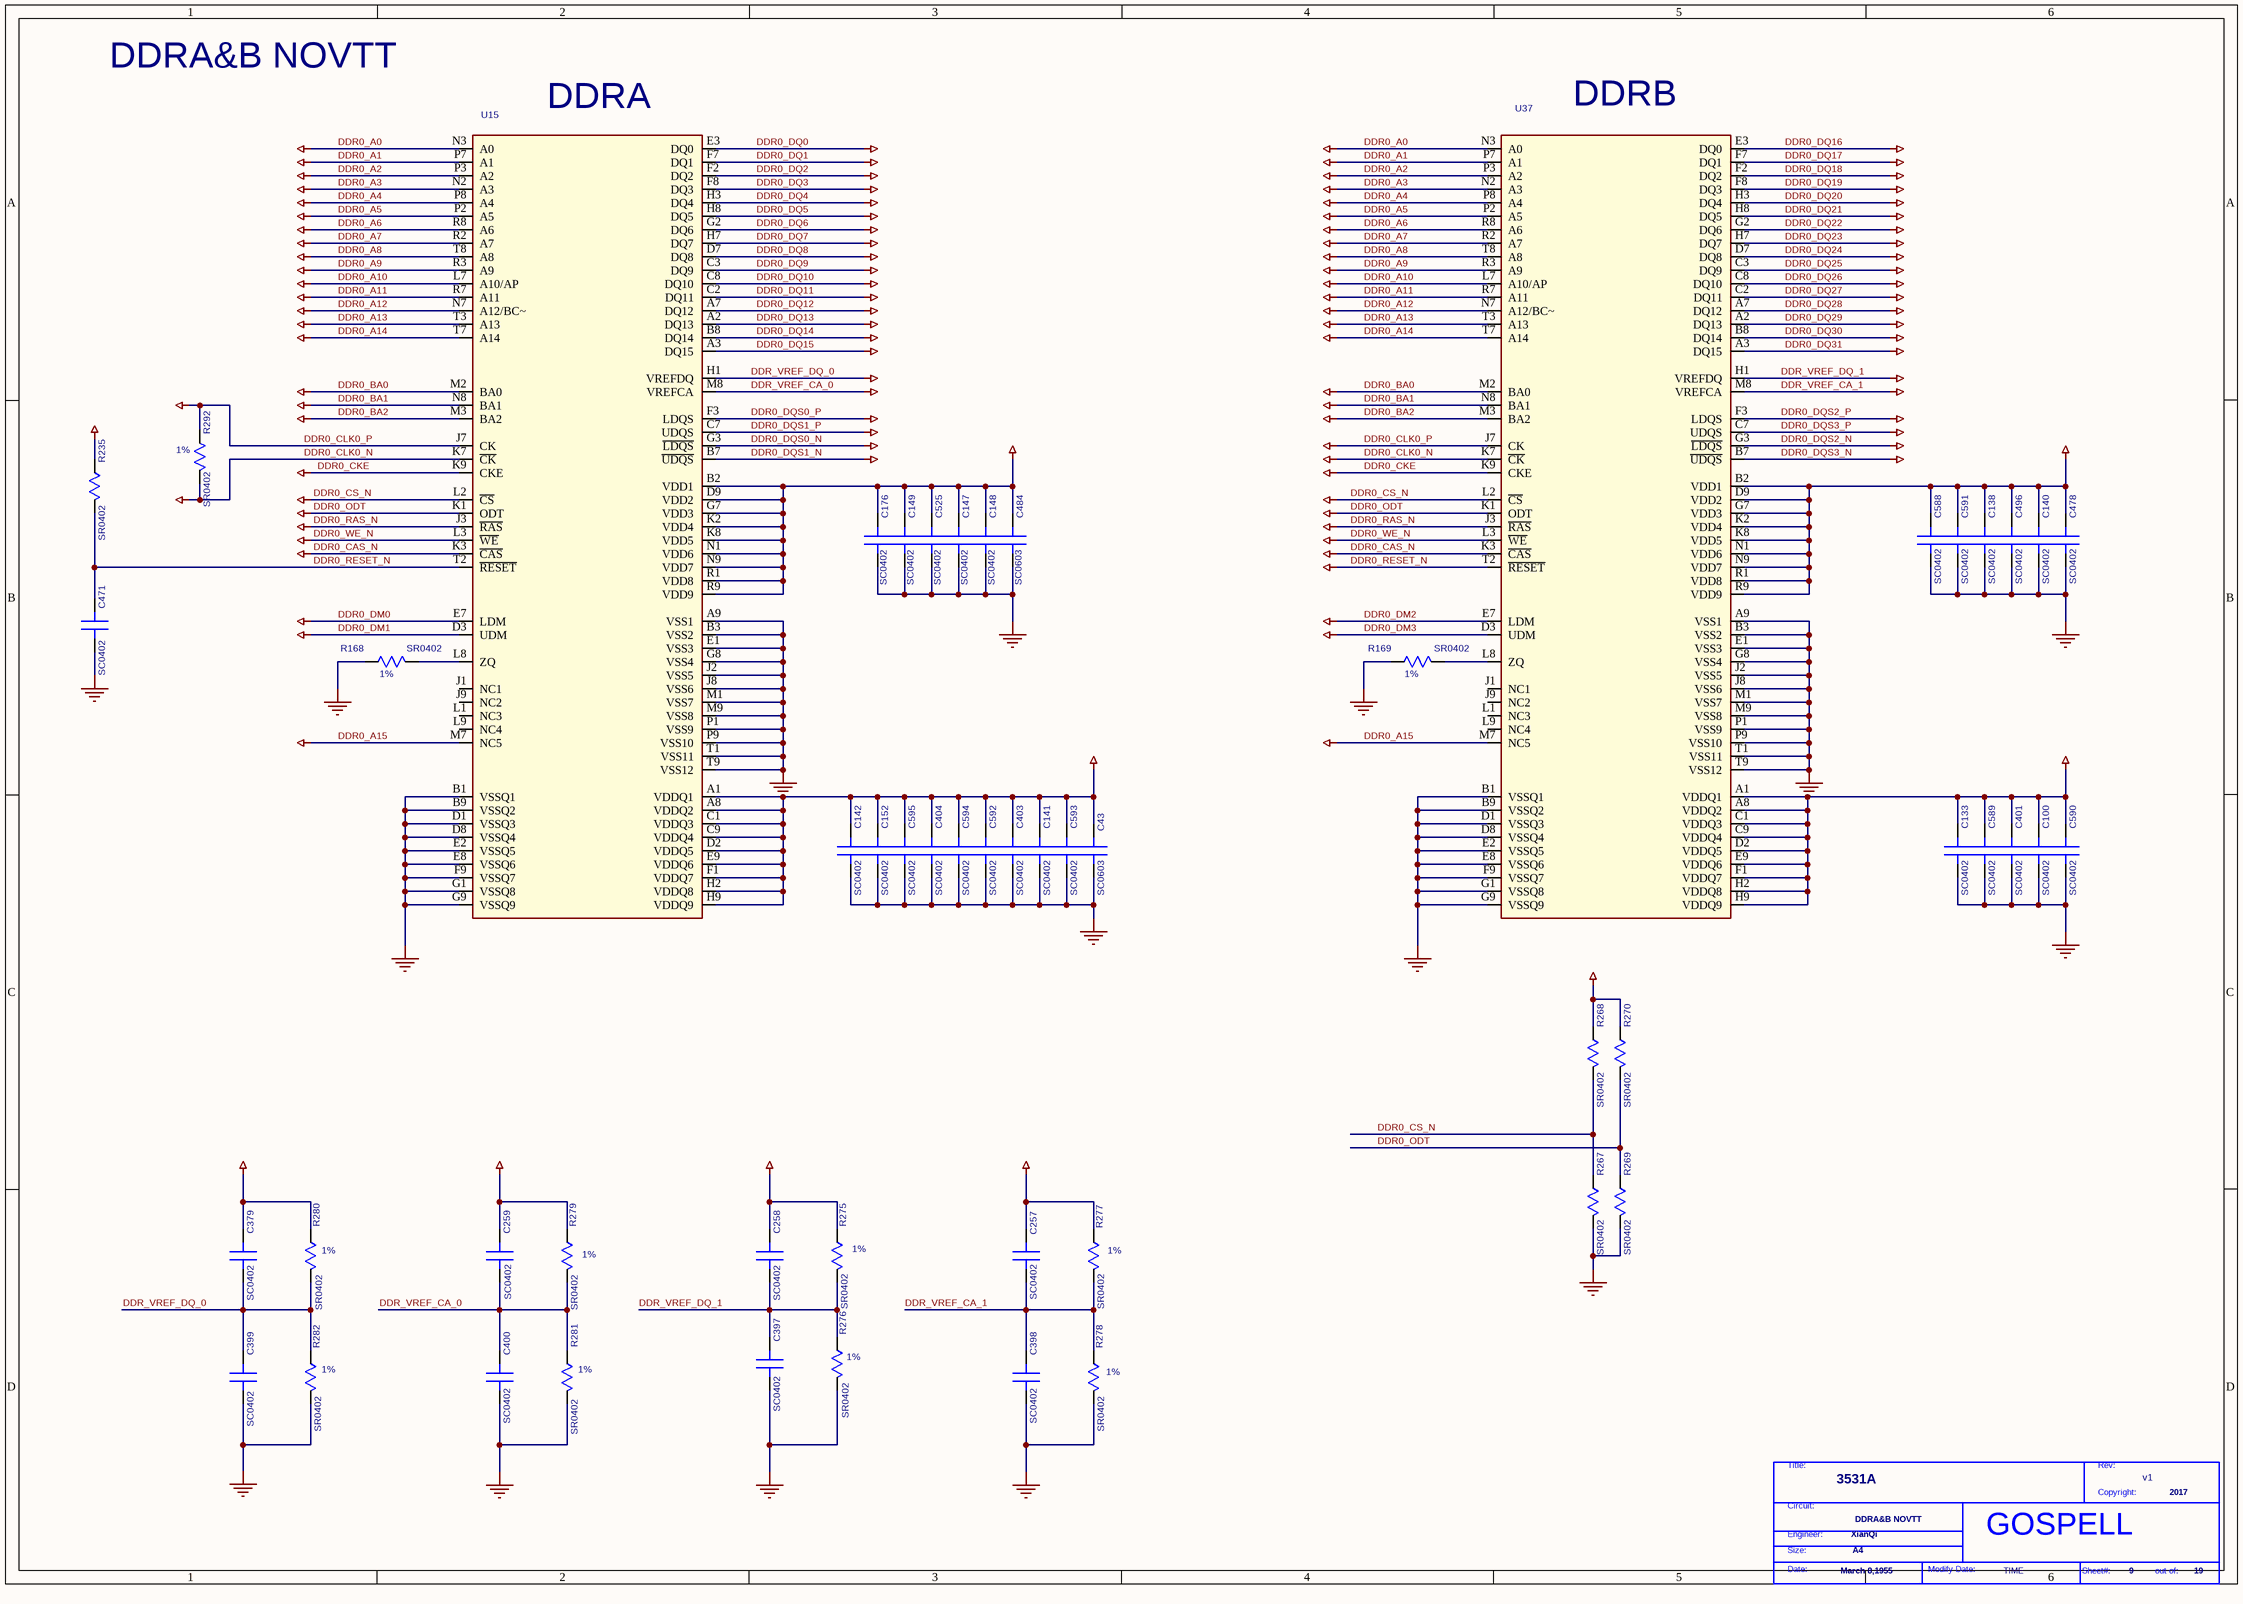
[diagram p9: P09 DDRA&B NOVTT.SchDoc]

### Parts
(Parts that share a designator on the sheet are numbered #1, #2 ... from top to bottom, then left to right.)
*#10  Page Modify Date: TIME  Engineer: XianQi  Copyright: 2017  Title: 3531A  RevCode: v1  Page Size: A4  Page Create Date: March 8,1955  Page Number: 9  Page Count: 19  Doc: DDRA&B NOVTT  (hidden comment: GOSPELL)  (graphical)
C43  SC0603  [SC0603]
C100  SC0402  [SC0402]
C133  SC0402  [SC0402]
C138  SC0402  [SC0402]
C140  SC0402  [SC0402]
C141  SC0402  [SC0402]
C142  SC0402  [SC0402]
C147  SC0402  [SC0402]
C148  SC0402  [SC0402]
C149  SC0402  [SC0402]
C152  SC0402  [SC0402]
C176  SC0402  [SC0402]
C257  SC0402  [SC0402]
C258  SC0402  [SC0402]
C259  SC0402  [SC0402]
C379  SC0402  [SC0402]
C397  SC0402  [SC0402]
C398  SC0402  [SC0402]
C399  SC0402  [SC0402]
C400  SC0402  [SC0402]
C401  SC0402  [SC0402]
C403  SC0402  [SC0402]
C404  SC0402  [SC0402]
C471  SC0402  [SC0402]
C478  SC0402  [SC0402]
C484  SC0603  [SC0603]
C496  SC0402  [SC0402]
C525  SC0402  [SC0402]
C588  SC0402  [SC0402]
C589  SC0402  [SC0402]
C590  SC0402  [SC0402]
C591  SC0402  [SC0402]
C592  SC0402  [SC0402]
C593  SC0402  [SC0402]
C594  SC0402  [SC0402]
C595  SC0402  [SC0402]
R168  SR0402  [SR0402]
R169  SR0402  [SR0402]
R235  SR0402  [SR0402]
R267  SR0402  [SR0402]
R268  SR0402  [SR0402]
R269  SR0402  [SR0402]
R270  SR0402  [SR0402]
R275  SR0402  [SR0402]
R276  SR0402  [SR0402]
R277  SR0402  [SR0402]
R278  SR0402  [SR0402]
R279  SR0402  [SR0402]
R280  SR0402  [SR0402]
R281  SR0402  [SR0402]
R282  SR0402  [SR0402]
R292  SR0402  [SR0402]
U15  BGA96-32-1609M  [BGA96-32-1609M]  (value not drawn)
U37  BGA96-32-1609M  [BGA96-32-1609M]  (value not drawn)

### Nets
1V5: C43.1(A) C100.1(A) C133.1(A) C138.1(A) C140.1(A) C141.1(A) C142.1(A) C147.1(A) C148.1(A) C149.1(A) C152.1(A) C176.1(A) C257.1(A) C258.1(A) C259.1(A) C379.1(A) C401.1(A) C403.1(A) C404.1(A) C478.1(A) C484.1(A) C496.1(A) C525.1(A) C588.1(A) C589.1(A) C590.1(A) C591.1(A) C592.1(A) C593.1(A) C594.1(A) C595.1(A) R235.1(A) R268.1(A) R270.1(A) R275.1(A) R277.1(A) R279.1(A) R280.1(A) U15.A1(VDDQ1) U15.A8(VDDQ2) U15.B2(VDD1) U15.C1(VDDQ3) U15.C9(VDDQ4) U15.D2(VDDQ5) U15.D9(VDD2) U15.E9(VDDQ6) U15.F1(VDDQ7) U15.G7(VDD3) U15.H2(VDDQ8) U15.H9(VDDQ9) U15.K2(VDD4) U15.K8(VDD5) U15.N1(VDD6) U15.N9(VDD7) U15.R1(VDD8) U15.R9(VDD9) U37.A1(VDDQ1) U37.A8(VDDQ2) U37.B2(VDD1) U37.C1(VDDQ3) U37.C9(VDDQ4) U37.D2(VDDQ5) U37.D9(VDD2) U37.E9(VDDQ6) U37.F1(VDDQ7) U37.G7(VDD3) U37.H2(VDDQ8) U37.H9(VDDQ9) U37.K2(VDD4) U37.K8(VDD5) U37.N1(VDD6) U37.N9(VDD7) U37.R1(VDD8) U37.R9(VDD9)
DDR0_A0: U15.N3(A0) U37.N3(A0)
DDR0_A1: U15.P7(A1) U37.P7(A1)
DDR0_A2: U15.P3(A2) U37.P3(A2)
DDR0_A3: U15.N2(A3) U37.N2(A3)
DDR0_A4: U15.P8(A4) U37.P8(A4)
DDR0_A5: U15.P2(A5) U37.P2(A5)
DDR0_A6: U15.R8(A6) U37.R8(A6)
DDR0_A7: U15.R2(A7) U37.R2(A7)
DDR0_A8: U15.T8(A8) U37.T8(A8)
DDR0_A9: U15.R3(A9) U37.R3(A9)
DDR0_A10: U15.L7(A10/AP) U37.L7(A10/AP)
DDR0_A11: U15.R7(A11) U37.R7(A11)
DDR0_A12: U15.N7(A12/BC~) U37.N7(A12/BC~)
DDR0_A13: U15.T3(A13) U37.T3(A13)
DDR0_A14: U15.T7(A14) U37.T7(A14)
DDR0_A15: U15.M7(NC5) U37.M7(NC5)
DDR0_BA0: U15.M2(BA0) U37.M2(BA0)
DDR0_BA1: U15.N8(BA1) U37.N8(BA1)
DDR0_BA2: U15.M3(BA2) U37.M3(BA2)
DDR0_CAS_N: U15.K3(~{CAS}) U37.K3(~{CAS})
DDR0_CKE: U15.K9(CKE) U37.K9(CKE)
DDR0_CLK0_N: R292.2(B) U15.K7(~{CK}) U37.K7(~{CK})
DDR0_CLK0_P: R292.1(A) U15.J7(CK) U37.J7(CK)
DDR0_CS_N: R267.1(A) R268.2(B) U15.L2(~{CS}) U37.L2(~{CS})
DDR0_DM0: U15.E7(LDM)
DDR0_DM1: U15.D3(UDM)
DDR0_DM2: U37.E7(LDM)
DDR0_DM3: U37.D3(UDM)
DDR0_DQ0: U15.E3(DQ0)
DDR0_DQ1: U15.F7(DQ1)
DDR0_DQ2: U15.F2(DQ2)
DDR0_DQ3: U15.F8(DQ3)
DDR0_DQ4: U15.H3(DQ4)
DDR0_DQ5: U15.H8(DQ5)
DDR0_DQ6: U15.G2(DQ6)
DDR0_DQ7: U15.H7(DQ7)
DDR0_DQ8: U15.D7(DQ8)
DDR0_DQ9: U15.C3(DQ9)
DDR0_DQ10: U15.C8(DQ10)
DDR0_DQ11: U15.C2(DQ11)
DDR0_DQ12: U15.A7(DQ12)
DDR0_DQ13: U15.A2(DQ13)
DDR0_DQ14: U15.B8(DQ14)
DDR0_DQ15: U15.A3(DQ15)
DDR0_DQ16: U37.E3(DQ0)
DDR0_DQ17: U37.F7(DQ1)
DDR0_DQ18: U37.F2(DQ2)
DDR0_DQ19: U37.F8(DQ3)
DDR0_DQ20: U37.H3(DQ4)
DDR0_DQ21: U37.H8(DQ5)
DDR0_DQ22: U37.G2(DQ6)
DDR0_DQ23: U37.H7(DQ7)
DDR0_DQ24: U37.D7(DQ8)
DDR0_DQ25: U37.C3(DQ9)
DDR0_DQ26: U37.C8(DQ10)
DDR0_DQ27: U37.C2(DQ11)
DDR0_DQ28: U37.A7(DQ12)
DDR0_DQ29: U37.A2(DQ13)
DDR0_DQ30: U37.B8(DQ14)
DDR0_DQ31: U37.A3(DQ15)
DDR0_DQS0_N: U15.G3(~{LDQS})
DDR0_DQS0_P: U15.F3(LDQS)
DDR0_DQS1_N: U15.B7(~{UDQS})
DDR0_DQS1_P: U15.C7(UDQS)
DDR0_DQS2_N: U37.G3(~{LDQS})
DDR0_DQS2_P: U37.F3(LDQS)
DDR0_DQS3_N: U37.B7(~{UDQS})
DDR0_DQS3_P: U37.C7(UDQS)
DDR0_ODT: R269.1(A) R270.2(B) U15.K1(ODT) U37.K1(ODT)
DDR0_RAS_N: U15.J3(~{RAS}) U37.J3(~{RAS})
DDR0_RESET_N: C471.1(A) R235.2(B) U15.T2(~{RESET}) U37.T2(~{RESET})
DDR0_WE_N: U15.L3(~{WE}) U37.L3(~{WE})
DDR_VREF_CA_0: C259.2(B) C400.1(A) R279.2(B) R281.1(A) U15.M8(VREFCA)
DDR_VREF_CA_1: C257.2(B) C398.1(A) R277.2(B) R278.1(A) U37.M8(VREFCA)
DDR_VREF_DQ_0: C379.2(B) C399.1(A) R280.2(B) R282.1(A) U15.H1(VREFDQ)
DDR_VREF_DQ_1: C258.2(B) C397.1(A) R275.2(B) R276.1(A) U37.H1(VREFDQ)
GND: C43.2(B) C100.2(B) C133.2(B) C138.2(B) C140.2(B) C141.2(B) C142.2(B) C147.2(B) C148.2(B) C149.2(B) C152.2(B) C176.2(B) C397.2(B) C398.2(B) C399.2(B) C400.2(B) C401.2(B) C403.2(B) C404.2(B) C471.2(B) C478.2(B) C484.2(B) C496.2(B) C525.2(B) C588.2(B) C589.2(B) C590.2(B) C591.2(B) C592.2(B) C593.2(B) C594.2(B) C595.2(B) R168.1(A) R169.1(A) R267.2(B) R269.2(B) R276.2(B) R278.2(B) R281.2(B) R282.2(B) U15.A9(VSS1) U15.B1(VSSQ1) U15.B3(VSS2) U15.B9(VSSQ2) U15.D1(VSSQ3) U15.D8(VSSQ4) U15.E1(VSS3) U15.E2(VSSQ5) U15.E8(VSSQ6) U15.F9(VSSQ7) U15.G1(VSSQ8) U15.G8(VSS4) U15.G9(VSSQ9) U15.J2(VSS5) U15.J8(VSS6) U15.M1(VSS7) U15.M9(VSS8) U15.P1(VSS9) U15.P9(VSS10) U15.T1(VSS11) U15.T9(VSS12) U37.A9(VSS1) U37.B1(VSSQ1) U37.B3(VSS2) U37.B9(VSSQ2) U37.D1(VSSQ3) U37.D8(VSSQ4) U37.E1(VSS3) U37.E2(VSSQ5) U37.E8(VSSQ6) U37.F9(VSSQ7) U37.G1(VSSQ8) U37.G8(VSS4) U37.G9(VSSQ9) U37.J2(VSS5) U37.J8(VSS6) U37.M1(VSS7) U37.M9(VSS8) U37.P1(VSS9) U37.P9(VSS10) U37.T1(VSS11) U37.T9(VSS12)
NetR168_2: R168.2(B) U15.L8(ZQ)
NetR169_2: R169.2(B) U37.L8(ZQ)

Not connected (* = marked no-connect by the designer): U15 J1(NC1) J9(NC2) L1(NC3) L9(NC4); U37 J1(NC1) J9(NC2) L1(NC3) L9(NC4)

### Notes on the sheet
- DDRA&B NOVTT
- (near U15) DDRA
- (near U37) DDRB
- (near R292) 1%
- (near R168) 1%
- (near R169) 1%
- (near R280) 1%
- (near R279) 1%
- (near R275) 1%
- (near R277) 1%
- (near R282) 1%
- (near R281) 1%
- (near R276) 1%
- (near R278) 1%
- (in symbol GOSPELL) Title:; Rev:; Copyright:; Circuit:; Engineer:; Size:; Date:; Modify Date:; Sheet#:; out of:

### Library data of the parts
C43 C484 = C_0_Dup2: PARTS: 1; PINSWAP: (A,B); LEVEL: STD; DEVICE: C1608X5R0J106MT0A0E; OriginalSymbolOrigin: (0,30); %208%%161%%192%%224%%195%%251%%179%%198%: SMD陶瓷电容; COMPONENT_HIGH_MAX: 0.9MM; %182%%238%%182%%168%%185%%164%%215%%247%%181%%231%%209%%185%(V): 6.3; %195%%232%%202%%246%: SMD陶瓷电容-6.3V-10000NF-+/-20%-X5R-0603-BT,TS16949; CODE: 8070649; PKG_TYPE: SC0603
C100 C147 = C_0_Dup2: as C171 on sheet P10 DDRC&D NOVTT; PKG_TYPE: SC0402
C133 C142 C258 C379 C397 C398 C400 C401 C404 C591 C592 = C_0_Dup2: as C213 on sheet P11 Hi3531A(SYSTEM)&RES; PKG_TYPE: SC0402
C138 C149 C152 C176 C257 C259 C399 C588 C589 C594 C595 = C_0_Dup2: as C204 on sheet P11 Hi3531A(SYSTEM)&RES; PKG_TYPE: SC0402
C140 C141 C478 = C_0_Dup2: as C168 on sheet P10 DDRC&D NOVTT; PKG_TYPE: SC0402
C148 C590 C593 = C_0_Dup2: as C161 on sheet P10 DDRC&D NOVTT; PKG_TYPE: SC0402
C403 C496 C525 = C_0_Dup2: as C169 on sheet P10 DDRC&D NOVTT; PKG_TYPE: SC0402
C471 = C_0_Dup2: as C472 on sheet P10 DDRC&D NOVTT; PKG_TYPE: SC0402
R168 = R_1: PARTS: 1; LEVEL: STD; DEVICE: RC0402FR_07240RL; PINSWAP: (A,B); OriginalSymbolOrigin: (10,20); %208%%161%%192%%224%%195%%251%%179%%198%: 片式厚膜电阻器; COMPONENT_HIGH_MAX: 0.4MM; %215%%232%%214%%181%%212%%202%%208%%237%%198%%171%%178%%238%: +/- 1%; %182%%238%%182%%168%%185%%166%%194%%202%(W): 0.06; %195%%232%%202%%246%: 片式厚膜电阻器-0.0625W-240OHM-+/- 1%-0402-BT; CODE: 7091782; PKG_TYPE: SR0402
R169 = R_1: as R170 on sheet P10 DDRC&D NOVTT; PKG_TYPE: SR0402
R235 = R_1: as R236 on sheet P10 DDRC&D NOVTT; PKG_TYPE: SR0402
R267 R270 = R_1: as R334 on sheet P11 Hi3531A(SYSTEM)&RES; PKG_TYPE: SR0402
R268 R269 = R_1: as R271 on sheet P10 DDRC&D NOVTT; PKG_TYPE: SR0402
R275 R278 R280-R282 = R_1: as R96 on sheet P11 Hi3531A(SYSTEM)&RES; PKG_TYPE: SR0402
R276 R277 R279 = R_1: as R283 on sheet P10 DDRC&D NOVTT; PKG_TYPE: SR0402
R292 = R_1: as R293 on sheet P10 DDRC&D NOVTT; PKG_TYPE: SR0402
U15 = MT41J256M16RE-15E-D_2: as U38 on sheet P10 DDRC&D NOVTT; PKG_TYPE: BGA96-32-1609M
U37 = MT41J256M16RE-15E-D_2: as U39 on sheet P10 DDRC&D NOVTT; PKG_TYPE: BGA96-32-1609M

## Sheet P08 Hi3531AV100(DDRC0 D.SchDoc
size 420 x 297 mm
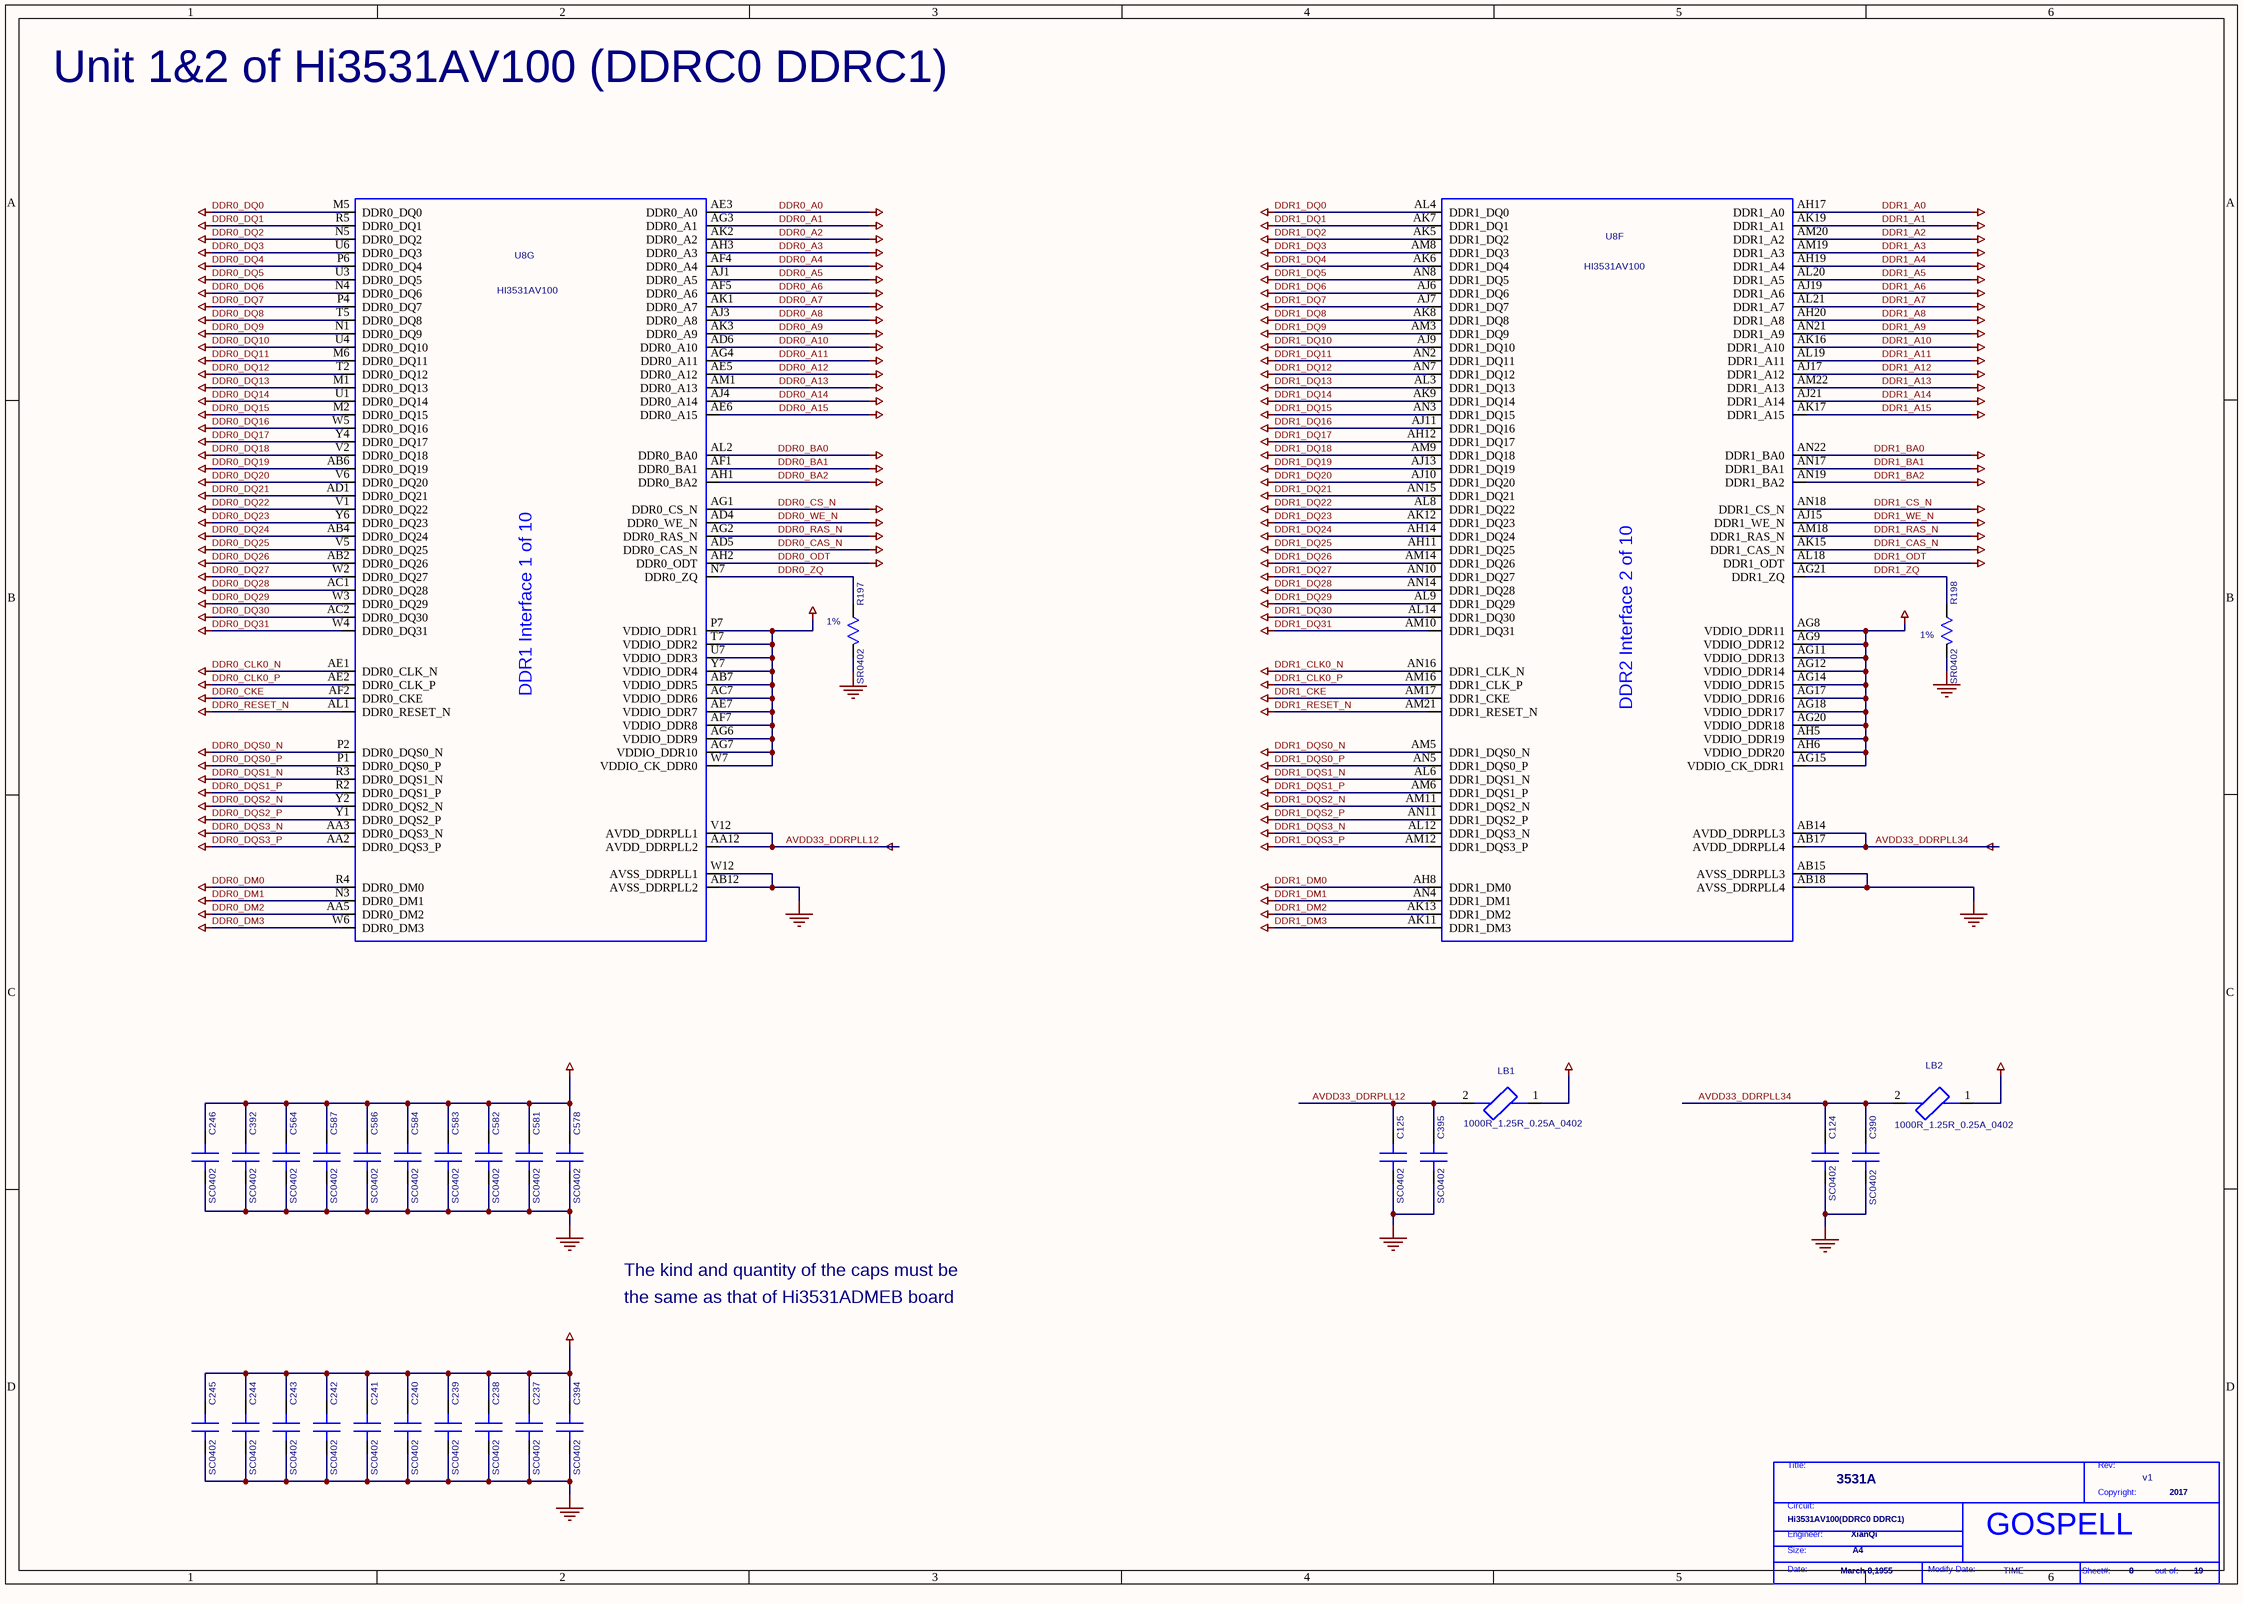
[diagram p10: P08 Hi3531AV100(DDRC0 D.SchDoc]

### Parts
(Parts that share a designator on the sheet are numbered #1, #2 ... from top to bottom, then left to right.)
*#11  Page Modify Date: TIME  Engineer: XianQi  Copyright: 2017  Title: 3531A  RevCode: v1  Page Size: A4  Page Create Date: March 8,1955  Page Number: 8  Page Count: 19  Doc: Hi3531AV100(DDRC0 DDRC1)  (hidden comment: GOSPELL)  (graphical)
C124  SC0402  [SC0402]
C125  SC0402  [SC0402]
C237  SC0402  [SC0402]
C238  SC0402  [SC0402]
C239  SC0402  [SC0402]
C240  SC0402  [SC0402]
C241  SC0402  [SC0402]
C242  SC0402  [SC0402]
C243  SC0402  [SC0402]
C244  SC0402  [SC0402]
C245  SC0402  [SC0402]
C246  SC0402  [SC0402]
C390  SC0402  [SC0402]
C392  SC0402  [SC0402]
C394  SC0402  [SC0402]
C395  SC0402  [SC0402]
C564  SC0402  [SC0402]
C578  SC0402  [SC0402]
C581  SC0402  [SC0402]
C582  SC0402  [SC0402]
C583  SC0402  [SC0402]
C584  SC0402  [SC0402]
C586  SC0402  [SC0402]
C587  SC0402  [SC0402]
LB1  SL0402  [SL0402]  (value not drawn)
LB2  SL0402  [SL0402]  (value not drawn)
R197  SR0402  [SR0402]
R198  SR0402  [SR0402]
U8  DEVICE: HI3531AV100  [BGA805-32-3333]  (hidden comment: BGA805-32-3333)  (parts F,G of 10)

### Nets
1V5: C237.1(A) C238.1(A) C239.1(A) C240.1(A) C241.1(A) C242.1(A) C243.1(A) C244.1(A) C245.1(A) C246.1(A) C392.1(A) C394.1(A) C564.1(A) C578.1(A) C581.1(A) C582.1(A) C583.1(A) C584.1(A) C586.1(A) C587.1(A) U8.AB7(VDDIO_DDR5) U8.AC7(VDDIO_DDR6) U8.AE7(VDDIO_DDR7) U8.AF7(VDDIO_DDR8) U8.AG6(VDDIO_DDR9) U8.AG7(VDDIO_DDR10) U8.AG8(VDDIO_DDR11) U8.AG9(VDDIO_DDR12) U8.AG11(VDDIO_DDR13) U8.AG12(VDDIO_DDR14) U8.AG14(VDDIO_DDR15) U8.AG15(VDDIO_CK_DDR1) U8.AG17(VDDIO_DDR16) U8.AG18(VDDIO_DDR17) U8.AG20(VDDIO_DDR18) U8.AH5(VDDIO_DDR19) U8.AH6(VDDIO_DDR20) U8.P7(VDDIO_DDR1) U8.T7(VDDIO_DDR2) U8.U7(VDDIO_DDR3) U8.W7(VDDIO_CK_DDR0) U8.Y7(VDDIO_DDR4)
3V3: LB1.1 LB2.1
AVDD33_DDRPLL12: C125.1(A) C395.1(A) LB1.2 U8.AA12(AVDD_DDRPLL2) U8.V12(AVDD_DDRPLL1)
AVDD33_DDRPLL34: C124.1(A) C390.1(A) LB2.2 U8.AB14(AVDD_DDRPLL3) U8.AB17(AVDD_DDRPLL4)
DDR0_A0: U8.AE3(DDR0_A0)
DDR0_A1: U8.AG3(DDR0_A1)
DDR0_A2: U8.AK2(DDR0_A2)
DDR0_A3: U8.AH3(DDR0_A3)
DDR0_A4: U8.AF4(DDR0_A4)
DDR0_A5: U8.AJ1(DDR0_A5)
DDR0_A6: U8.AF5(DDR0_A6)
DDR0_A7: U8.AK1(DDR0_A7)
DDR0_A8: U8.AJ3(DDR0_A8)
DDR0_A9: U8.AK3(DDR0_A9)
DDR0_A10: U8.AD6(DDR0_A10)
DDR0_A11: U8.AG4(DDR0_A11)
DDR0_A12: U8.AE5(DDR0_A12)
DDR0_A13: U8.AM1(DDR0_A13)
DDR0_A14: U8.AJ4(DDR0_A14)
DDR0_A15: U8.AE6(DDR0_A15)
DDR0_BA0: U8.AL2(DDR0_BA0)
DDR0_BA1: U8.AF1(DDR0_BA1)
DDR0_BA2: U8.AH1(DDR0_BA2)
DDR0_CAS_N: U8.AD5(DDR0_CAS_N)
DDR0_CKE: U8.AF2(DDR0_CKE)
DDR0_CLK0_N: U8.AE1(DDR0_CLK_N)
DDR0_CLK0_P: U8.AE2(DDR0_CLK_P)
DDR0_CS_N: U8.AG1(DDR0_CS_N)
DDR0_DM0: U8.R4(DDR0_DM0)
DDR0_DM1: U8.N3(DDR0_DM1)
DDR0_DM2: U8.AA5(DDR0_DM2)
DDR0_DM3: U8.W6(DDR0_DM3)
DDR0_DQ0: U8.M5(DDR0_DQ0)
DDR0_DQ1: U8.R5(DDR0_DQ1)
DDR0_DQ2: U8.N5(DDR0_DQ2)
DDR0_DQ3: U8.U6(DDR0_DQ3)
DDR0_DQ4: U8.P6(DDR0_DQ4)
DDR0_DQ5: U8.U3(DDR0_DQ5)
DDR0_DQ6: U8.N4(DDR0_DQ6)
DDR0_DQ7: U8.P4(DDR0_DQ7)
DDR0_DQ8: U8.T5(DDR0_DQ8)
DDR0_DQ9: U8.N1(DDR0_DQ9)
DDR0_DQ10: U8.U4(DDR0_DQ10)
DDR0_DQ11: U8.M6(DDR0_DQ11)
DDR0_DQ12: U8.T2(DDR0_DQ12)
DDR0_DQ13: U8.M1(DDR0_DQ13)
DDR0_DQ14: U8.U1(DDR0_DQ14)
DDR0_DQ15: U8.M2(DDR0_DQ15)
DDR0_DQ16: U8.W5(DDR0_DQ16)
DDR0_DQ17: U8.Y4(DDR0_DQ17)
DDR0_DQ18: U8.V2(DDR0_DQ18)
DDR0_DQ19: U8.AB6(DDR0_DQ19)
DDR0_DQ20: U8.V6(DDR0_DQ20)
DDR0_DQ21: U8.AD1(DDR0_DQ21)
DDR0_DQ22: U8.V1(DDR0_DQ22)
DDR0_DQ23: U8.Y6(DDR0_DQ23)
DDR0_DQ24: U8.AB4(DDR0_DQ24)
DDR0_DQ25: U8.V5(DDR0_DQ25)
DDR0_DQ26: U8.AB2(DDR0_DQ26)
DDR0_DQ27: U8.W2(DDR0_DQ27)
DDR0_DQ28: U8.AC1(DDR0_DQ28)
DDR0_DQ29: U8.W3(DDR0_DQ29)
DDR0_DQ30: U8.AC2(DDR0_DQ30)
DDR0_DQ31: U8.W4(DDR0_DQ31)
DDR0_DQS0_N: U8.P2(DDR0_DQS0_N)
DDR0_DQS0_P: U8.P1(DDR0_DQS0_P)
DDR0_DQS1_N: U8.R3(DDR0_DQS1_N)
DDR0_DQS1_P: U8.R2(DDR0_DQS1_P)
DDR0_DQS2_N: U8.Y2(DDR0_DQS2_N)
DDR0_DQS2_P: U8.Y1(DDR0_DQS2_P)
DDR0_DQS3_N: U8.AA3(DDR0_DQS3_N)
DDR0_DQS3_P: U8.AA2(DDR0_DQS3_P)
DDR0_ODT: U8.AH2(DDR0_ODT)
DDR0_RAS_N: U8.AG2(DDR0_RAS_N)
DDR0_RESET_N: U8.AL1(DDR0_RESET_N)
DDR0_WE_N: U8.AD4(DDR0_WE_N)
DDR1_A0: U8.AH17(DDR1_A0)
DDR1_A1: U8.AK19(DDR1_A1)
DDR1_A2: U8.AM20(DDR1_A2)
DDR1_A3: U8.AM19(DDR1_A3)
DDR1_A4: U8.AH19(DDR1_A4)
DDR1_A5: U8.AL20(DDR1_A5)
DDR1_A6: U8.AJ19(DDR1_A6)
DDR1_A7: U8.AL21(DDR1_A7)
DDR1_A8: U8.AH20(DDR1_A8)
DDR1_A9: U8.AN21(DDR1_A9)
DDR1_A10: U8.AK16(DDR1_A10)
DDR1_A11: U8.AL19(DDR1_A11)
DDR1_A12: U8.AJ17(DDR1_A12)
DDR1_A13: U8.AM22(DDR1_A13)
DDR1_A14: U8.AJ21(DDR1_A14)
DDR1_A15: U8.AK17(DDR1_A15)
DDR1_BA0: U8.AN22(DDR1_BA0)
DDR1_BA1: U8.AN17(DDR1_BA1)
DDR1_BA2: U8.AN19(DDR1_BA2)
DDR1_CAS_N: U8.AK15(DDR1_CAS_N)
DDR1_CKE: U8.AM17(DDR1_CKE)
DDR1_CLK0_N: U8.AN16(DDR1_CLK_N)
DDR1_CLK0_P: U8.AM16(DDR1_CLK_P)
DDR1_CS_N: U8.AN18(DDR1_CS_N)
DDR1_DM0: U8.AH8(DDR1_DM0)
DDR1_DM1: U8.AN4(DDR1_DM1)
DDR1_DM2: U8.AK13(DDR1_DM2)
DDR1_DM3: U8.AK11(DDR1_DM3)
DDR1_DQ0: U8.AL4(DDR1_DQ0)
DDR1_DQ1: U8.AK7(DDR1_DQ1)
DDR1_DQ2: U8.AK5(DDR1_DQ2)
DDR1_DQ3: U8.AM8(DDR1_DQ3)
DDR1_DQ4: U8.AK6(DDR1_DQ4)
DDR1_DQ5: U8.AN8(DDR1_DQ5)
DDR1_DQ6: U8.AJ6(DDR1_DQ6)
DDR1_DQ7: U8.AJ7(DDR1_DQ7)
DDR1_DQ8: U8.AK8(DDR1_DQ8)
DDR1_DQ9: U8.AM3(DDR1_DQ9)
DDR1_DQ10: U8.AJ9(DDR1_DQ10)
DDR1_DQ11: U8.AN2(DDR1_DQ11)
DDR1_DQ12: U8.AN7(DDR1_DQ12)
DDR1_DQ13: U8.AL3(DDR1_DQ13)
DDR1_DQ14: U8.AK9(DDR1_DQ14)
DDR1_DQ15: U8.AN3(DDR1_DQ15)
DDR1_DQ16: U8.AJ11(DDR1_DQ16)
DDR1_DQ17: U8.AH12(DDR1_DQ17)
DDR1_DQ18: U8.AM9(DDR1_DQ18)
DDR1_DQ19: U8.AJ13(DDR1_DQ19)
DDR1_DQ20: U8.AJ10(DDR1_DQ20)
DDR1_DQ21: U8.AN15(DDR1_DQ21)
DDR1_DQ22: U8.AL8(DDR1_DQ22)
DDR1_DQ23: U8.AK12(DDR1_DQ23)
DDR1_DQ24: U8.AH14(DDR1_DQ24)
DDR1_DQ25: U8.AH11(DDR1_DQ25)
DDR1_DQ26: U8.AM14(DDR1_DQ26)
DDR1_DQ27: U8.AN10(DDR1_DQ27)
DDR1_DQ28: U8.AN14(DDR1_DQ28)
DDR1_DQ29: U8.AL9(DDR1_DQ29)
DDR1_DQ30: U8.AL14(DDR1_DQ30)
DDR1_DQ31: U8.AM10(DDR1_DQ31)
DDR1_DQS0_N: U8.AM5(DDR1_DQS0_N)
DDR1_DQS0_P: U8.AN5(DDR1_DQS0_P)
DDR1_DQS1_N: U8.AL6(DDR1_DQS1_N)
DDR1_DQS1_P: U8.AM6(DDR1_DQS1_P)
DDR1_DQS2_N: U8.AM11(DDR1_DQS2_N)
DDR1_DQS2_P: U8.AN11(DDR1_DQS2_P)
DDR1_DQS3_N: U8.AL12(DDR1_DQS3_N)
DDR1_DQS3_P: U8.AM12(DDR1_DQS3_P)
DDR1_ODT: U8.AL18(DDR1_ODT)
DDR1_RAS_N: U8.AM18(DDR1_RAS_N)
DDR1_RESET_N: U8.AM21(DDR1_RESET_N)
DDR1_WE_N: U8.AJ15(DDR1_WE_N)
GND: C124.2(B) C125.2(B) C237.2(B) C238.2(B) C239.2(B) C240.2(B) C241.2(B) C242.2(B) C243.2(B) C244.2(B) C245.2(B) C246.2(B) C390.2(B) C392.2(B) C394.2(B) C395.2(B) C564.2(B) C578.2(B) C581.2(B) C582.2(B) C583.2(B) C584.2(B) C586.2(B) C587.2(B) R197.2(B) R198.2(B) U8.AB12(AVSS_DDRPLL2) U8.AB15(AVSS_DDRPLL3) U8.AB18(AVSS_DDRPLL4) U8.W12(AVSS_DDRPLL1)
DDR0_ZQ: R197.1(A) U8.N7(DDR0_ZQ)
DDR1_ZQ: R198.1(A) U8.AG21(DDR1_ZQ)

### Notes on the sheet
- Unit 1&2 of Hi3531AV100 (DDRC0 DDRC1)
- (near R197) 1%
- (near R198) 1%
- (near LB1) 1000R_1.25R_0.25A_0402
- (near LB2) 1000R_1.25R_0.25A_0402
- the same as that of Hi3531ADMEB board
- The kind and quantity of the caps must be
- (in symbol GOSPELL) Title:; Rev:; Copyright:; Circuit:; Engineer:; Size:; Date:; Modify Date:; Sheet#:; out of:
- (in symbol HI3531AV100_M2_17, part F) DDR2 Interface 2 of 10
- (in symbol HI3531AV100_M2_17, part G) DDR1 Interface 1 of 10

### Library data of the parts
C124 = C_0_Dup2: PARTS: 1; PINSWAP: (A,B); LEVEL: STD; DEVICE: RMEMK105BJ104KV_FR; OriginalSymbolOrigin: (0,30); %208%%161%%192%%224%%195%%251%%179%%198%: SMD陶瓷电容; COMPONENT_HIGH_MAX: 0.6MM; %182%%238%%182%%168%%185%%164%%215%%247%%181%%231%%209%%185%(V): 16; %195%%232%%202%%246%: SMD陶瓷电容-16V-100NF-+/-10%-X7R-0402-BT; CODE: 8070614; PKG_TYPE: SC0402
C125 = C_0_Dup2: PARTS: 1; PINSWAP: (A,B); LEVEL: STD; DEVICE: RMEMK105BJ104KV_FR; OriginalSymbolOrigin: (0,30); CODE: 8070614; %195%%232%%202%%246%: SMD陶瓷电容-16V-100NF-+/-10%-X7R-0402-BT; %182%%238%%182%%168%%185%%164%%215%%247%%181%%231%%209%%185%(V): 16; COMPONENT_HIGH_MAX: 0.6MM; %208%%161%%192%%224%%195%%251%%179%%198%: SMD陶瓷电容; PKG_TYPE: SC0402
C237 C239 C241 C243 C245 C390 C392 C394 C578 C582 C584 C587 = C_0_Dup2: as C168 on sheet P10 DDRC&D NOVTT; PKG_TYPE: SC0402
C238 C240 C242 C244 C246 C395 C564 C581 C583 C586 = C_0_Dup2: as C161 on sheet P10 DDRC&D NOVTT; PKG_TYPE: SC0402
LB1 LB2 = LB_0: PARTS: 1; DEVICE: BLM15HG102SN1D; LEVEL: STD; OriginalSymbolOrigin: (20,50); CODE: 10070019; %195%%232%%202%%246%: EMI磁珠-+/-25%-1000OHM-1.25OHM-0.25A-0402-1400OHM@1GHZ-1400OHM@1GHZ; COMPONENT_HIGH_MAX: 0.55MM; %208%%161%%192%%224%%195%%251%%179%%198%: EMI磁珠; PKG_TYPE: SL0402
R197 R198 = R_1: as R170 on sheet P10 DDRC&D NOVTT; PKG_TYPE: SR0402
U8 = HI3531AV100_M2_17: FORWARD_PCB: 1; HETERO: (HI3531AV100_DDR1),(HI3531AV100_DDR2),(HI3531AV100_SYSTEM),(HI3531AV100_AD),(HI3531AV100_VO),(HI3531AV100_M1),(HI3531AV100_M2),(HI3531AV100_POWER),(HI3531AV100_VSS1),(HI3531AV100_VSS2); LEVEL: STD; OriginalSymbolOrigin: (30,630); CODE: 35020607; CaptureCellPackProp: HI3531AV100_M2F; PARTS: 1; PKG_TYPE: BGA805-32-3333

## Sheet P07 Hi3531AV100(POWER).SchDoc
size 420 x 297 mm
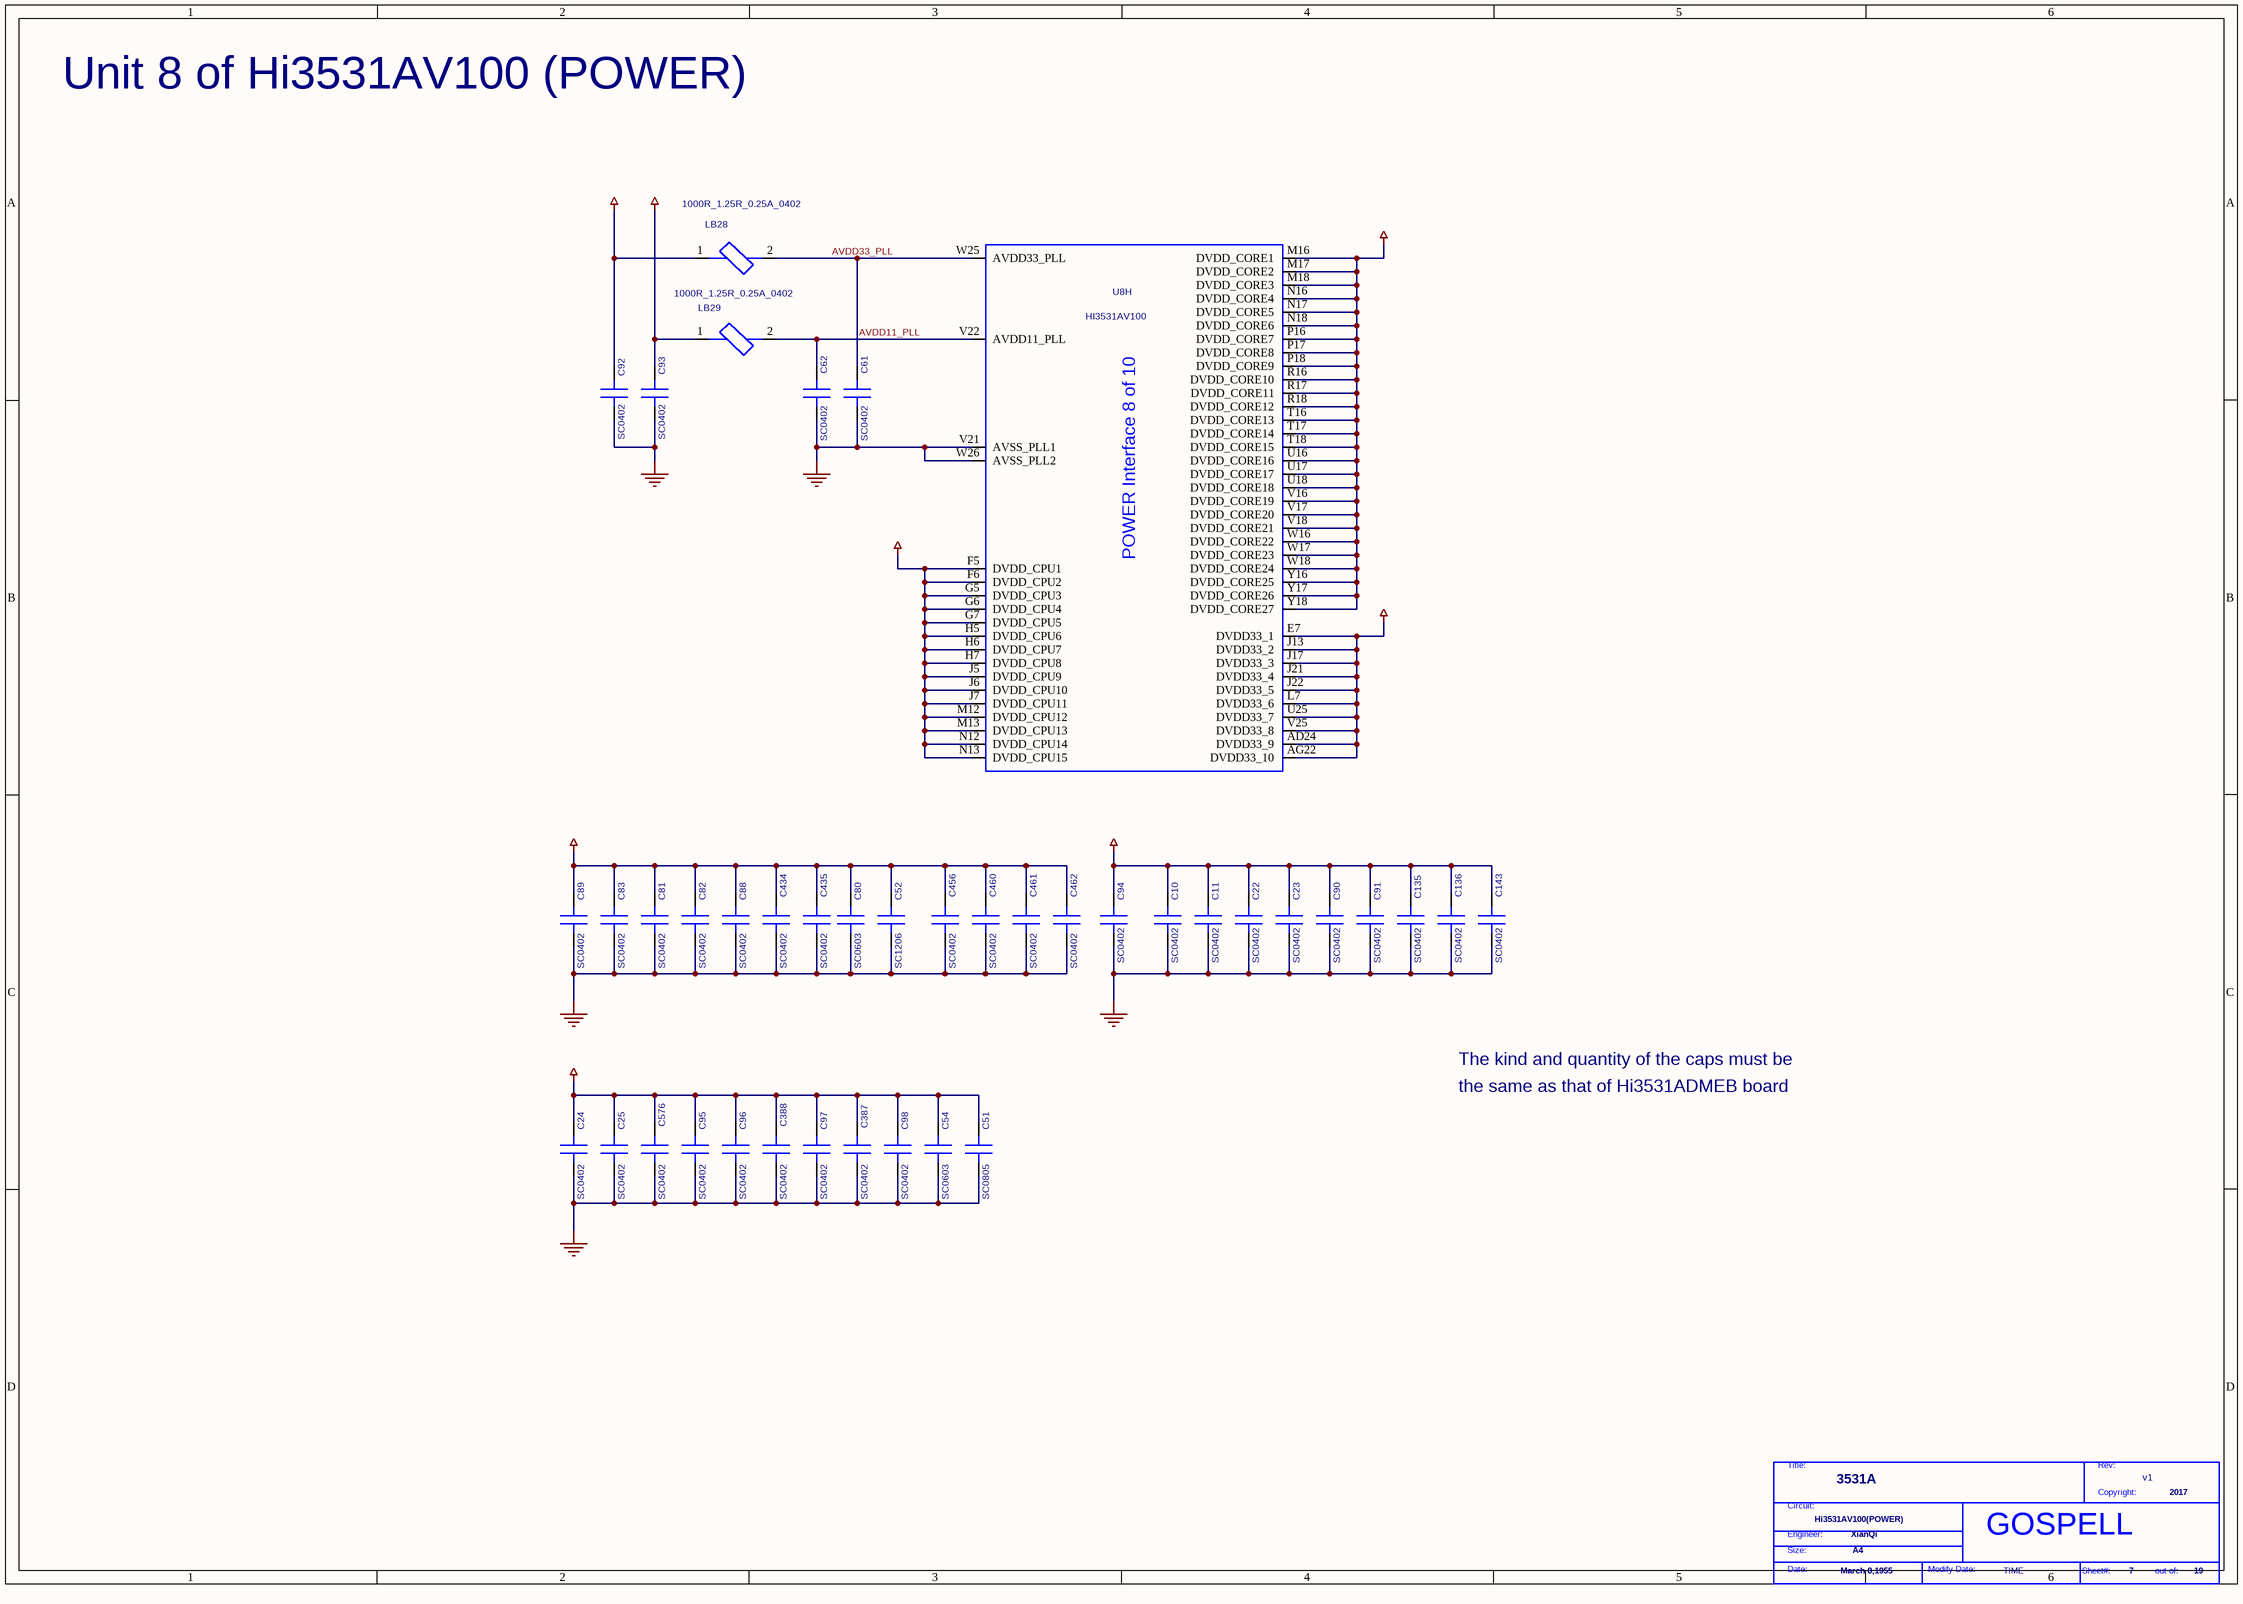
[diagram p11: P07 Hi3531AV100(POWER).SchDoc]

### Parts
(Parts that share a designator on the sheet are numbered #1, #2 ... from top to bottom, then left to right.)
*#12  Page Modify Date: TIME  Engineer: XianQi  Copyright: 2017  Title: 3531A  RevCode: v1  Page Size: A4  Page Create Date: March 8,1955  Page Number: 7  Page Count: 19  Doc: Hi3531AV100(POWER)  (hidden comment: GOSPELL)  (graphical)
C10  SC0402  [SC0402]
C11  SC0402  [SC0402]
C22  SC0402  [SC0402]
C23  SC0402  [SC0402]
C24  SC0402  [SC0402]
C25  SC0402  [SC0402]
C51  SC0805  [SC0805]
C52  SC1206  [SC1206]
C54  SC0603  [SC0603]
C61  SC0402  [SC0402]
C62  SC0402  [SC0402]
C80  SC0603  [SC0603]
C81  SC0402  [SC0402]
C82  SC0402  [SC0402]
C83  SC0402  [SC0402]
C88  SC0402  [SC0402]
C89  SC0402  [SC0402]
C90  SC0402  [SC0402]
C91  SC0402  [SC0402]
C92  SC0402  [SC0402]
C93  SC0402  [SC0402]
C94  SC0402  [SC0402]
C95  SC0402  [SC0402]
C96  SC0402  [SC0402]
C97  SC0402  [SC0402]
C98  SC0402  [SC0402]
C135  SC0402  [SC0402]
C136  SC0402  [SC0402]
C143  SC0402  [SC0402]
C387  SC0402  [SC0402]
C388  SC0402  [SC0402]
C434  SC0402  [SC0402]
C435  SC0402  [SC0402]
C456  SC0402  [SC0402]
C460  SC0402  [SC0402]
C461  SC0402  [SC0402]
C462  SC0402  [SC0402]
C576  SC0402  [SC0402]
LB28  SL0402  [SL0402]  (value not drawn)
LB29  SL0402  [SL0402]  (value not drawn)
U8  DEVICE: HI3531AV100  [BGA805-32-3333]  (hidden comment: BGA805-32-3333)  (part H of 10)

### Nets
3V3: C10.1(A) C11.1(A) C22.1(A) C23.1(A) C90.1(A) C91.1(A) C92.1(A) C94.1(A) C135.1(A) C136.1(A) C143.1(A) LB28.1 U8.AD24(DVDD33_9) U8.AG22(DVDD33_10) U8.E7(DVDD33_1) U8.J13(DVDD33_2) U8.J17(DVDD33_3) U8.J21(DVDD33_4) U8.J22(DVDD33_5) U8.L7(DVDD33_6) U8.U25(DVDD33_7) U8.V25(DVDD33_8)
DVDD_CORE: C24.1(A) C25.1(A) C51.1(A) C54.1(A) C93.1(A) C95.1(A) C96.1(A) C97.1(A) C98.1(A) C387.1(A) C388.1(A) C576.1(A) LB29.1 U8.M16(DVDD_CORE1) U8.M17(DVDD_CORE2) U8.M18(DVDD_CORE3) U8.N16(DVDD_CORE4) U8.N17(DVDD_CORE5) U8.N18(DVDD_CORE6) U8.P16(DVDD_CORE7) U8.P17(DVDD_CORE8) U8.P18(DVDD_CORE9) U8.R16(DVDD_CORE10) U8.R17(DVDD_CORE11) U8.R18(DVDD_CORE12) U8.T16(DVDD_CORE13) U8.T17(DVDD_CORE14) U8.T18(DVDD_CORE15) U8.U16(DVDD_CORE16) U8.U17(DVDD_CORE17) U8.U18(DVDD_CORE18) U8.V16(DVDD_CORE19) U8.V17(DVDD_CORE20) U8.V18(DVDD_CORE21) U8.W16(DVDD_CORE22) U8.W17(DVDD_CORE23) U8.W18(DVDD_CORE24) U8.Y16(DVDD_CORE25) U8.Y17(DVDD_CORE26) U8.Y18(DVDD_CORE27)
DVDD_CPU: C52.1(A) C80.1(A) C81.1(A) C82.1(A) C83.1(A) C88.1(A) C89.1(A) C434.1(A) C435.1(A) C456.1(A) C460.1(A) C461.1(A) C462.1(A) U8.F5(DVDD_CPU1) U8.F6(DVDD_CPU2) U8.G5(DVDD_CPU3) U8.G6(DVDD_CPU4) U8.G7(DVDD_CPU5) U8.H5(DVDD_CPU6) U8.H6(DVDD_CPU7) U8.H7(DVDD_CPU8) U8.J5(DVDD_CPU9) U8.J6(DVDD_CPU10) U8.J7(DVDD_CPU11) U8.M12(DVDD_CPU12) U8.M13(DVDD_CPU13) U8.N12(DVDD_CPU14) U8.N13(DVDD_CPU15)
GND: C10.2(B) C11.2(B) C22.2(B) C23.2(B) C24.2(B) C25.2(B) C51.2(B) C52.2(B) C54.2(B) C61.2(B) C62.2(B) C80.2(B) C81.2(B) C82.2(B) C83.2(B) C88.2(B) C89.2(B) C90.2(B) C91.2(B) C92.2(B) C93.2(B) C94.2(B) C95.2(B) C96.2(B) C97.2(B) C98.2(B) C135.2(B) C136.2(B) C143.2(B) C387.2(B) C388.2(B) C434.2(B) C435.2(B) C456.2(B) C460.2(B) C461.2(B) C462.2(B) C576.2(B) U8.V21(AVSS_PLL1) U8.W26(AVSS_PLL2)
AVDD11_PLL: C62.1(A) LB29.2 U8.V22(AVDD11_PLL)
AVDD33_PLL: C61.1(A) LB28.2 U8.W25(AVDD33_PLL)

### Notes on the sheet
- Unit 8 of Hi3531AV100 (POWER)
- (near LB28) 1000R_1.25R_0.25A_0402
- 1000R_1.25R_0.25A_0402
- The kind and quantity of the caps must be
- the same as that of Hi3531ADMEB board
- (in symbol GOSPELL) Title:; Rev:; Copyright:; Circuit:; Engineer:; Size:; Date:; Modify Date:; Sheet#:; out of:
- (in symbol HI3531AV100_M2_17, part H) POWER Interface 8 of 10

### Library data of the parts
C10 C23 C90 C135 C143 = C_0_Dup2: as C124 on sheet P08 Hi3531AV100(DDRC0 D; PKG_TYPE: SC0402
C11 C22 C91 C136 = C_0_Dup2: as C125 on sheet P08 Hi3531AV100(DDRC0 D; PKG_TYPE: SC0402
C24 C61 C82 C88 C92 C96 C98 C388 C434 C456 C461 C576 = C_0_Dup2: as C161 on sheet P10 DDRC&D NOVTT; PKG_TYPE: SC0402
C25 C62 C81 C83 C89 C93 C95 C97 C387 C435 C460 C462 = C_0_Dup2: as C168 on sheet P10 DDRC&D NOVTT; PKG_TYPE: SC0402
C51 = C_0_Dup2: PARTS: 1; PINSWAP: (A,B); LEVEL: STD; DEVICE: C2012X5R0J226MT000N; OriginalSymbolOrigin: (0,30); %208%%161%%192%%224%%195%%251%%179%%198%: SMD陶瓷电容; COMPONENT_HIGH_MAX: 1.35MM; %182%%238%%182%%168%%185%%164%%215%%247%%181%%231%%209%%185%(V): 6.3; %195%%232%%202%%246%: SMD陶瓷电容-6.3V-22000NF-+/-20%-X5R-0805-08070784编码拆分供华为技术使用; CODE: 8071114; PKG_TYPE: SC0805
C52 = C_0_Dup2: PARTS: 1; PINSWAP: (A,B); LEVEL: STD; DEVICE: GRM31CR60J226ME19L; OriginalSymbolOrigin: (0,30); %208%%161%%192%%224%%195%%251%%179%%198%: SMD陶瓷电容; COMPONENT_HIGH_MAX: 1.9MM; %182%%238%%182%%168%%185%%164%%215%%247%%181%%231%%209%%185%(V): 6.3; %195%%232%%202%%246%: SMD陶瓷电容-6.3V-22000NF-+/-20%-X5R-1206-BT,TS16949; CODE: 8070630; PKG_TYPE: SC1206
C54 C80 = C_0_Dup2: as C45 on sheet P10 DDRC&D NOVTT; PKG_TYPE: SC0603
C94 = C_0_Dup2: PARTS: 1; PINSWAP: (A,B); LEVEL: STD; DEVICE: RMEMK105BJ104KV_FR; OriginalSymbolOrigin: (0,30); %208%%161%%192%%224%%195%%251%%179%%198%: SMD陶瓷电容; COMPONENT_HIGH_MAX: 0.6MM; %182%%238%%182%%168%%185%%164%%215%%247%%181%%231%%209%%185%(V): 16; %195%%232%%202%%246%: SMD陶瓷电容-16V-100NF-±10%-X7R-0402; CODE: 8070614; PKG_TYPE: SC0402
LB28 LB29 = LB_0: PARTS: 1; DEVICE: BLM15HG102SN1D; LEVEL: STD; OriginalSymbolOrigin: (20,50); %208%%161%%192%%224%%195%%251%%179%%198%: EMI磁珠; COMPONENT_HIGH_MAX: 0.55MM; %195%%232%%202%%246%: EMI磁珠-+/-25%-1000OHM-1.25OHM-0.25A-0402-1400OHM@1GHZ-1400OHM@1GHZ; CODE: 10070019; PKG_TYPE: SL0402
U8 = HI3531AV100_M2_17: FORWARD_PCB: 1; HETERO: (HI3531AV100_DDR1),(HI3531AV100_DDR2),(HI3531AV100_SYSTEM),(HI3531AV100_AD),(HI3531AV100_VO),(HI3531AV100_M1),(HI3531AV100_M2),(HI3531AV100_POWER),(HI3531AV100_VSS1),(HI3531AV100_VSS2); LEVEL: STD; OriginalSymbolOrigin: (30,630); CODE: 35020607; CaptureCellPackProp: HI3531AV100_M2H; PARTS: 1; PKG_TYPE: BGA805-32-3333